# EasyEDA schematic SCH_AidF-Car-Navigation-Computer.json

## Sheets
1 Power Inlet: TITLE: AidF Nav Computer Power Inlet; REV: 1.0; Date: 2024-11-23; Sheet: 1/12; Drawn By: Aidan C Franits; Company: AidF Electronics
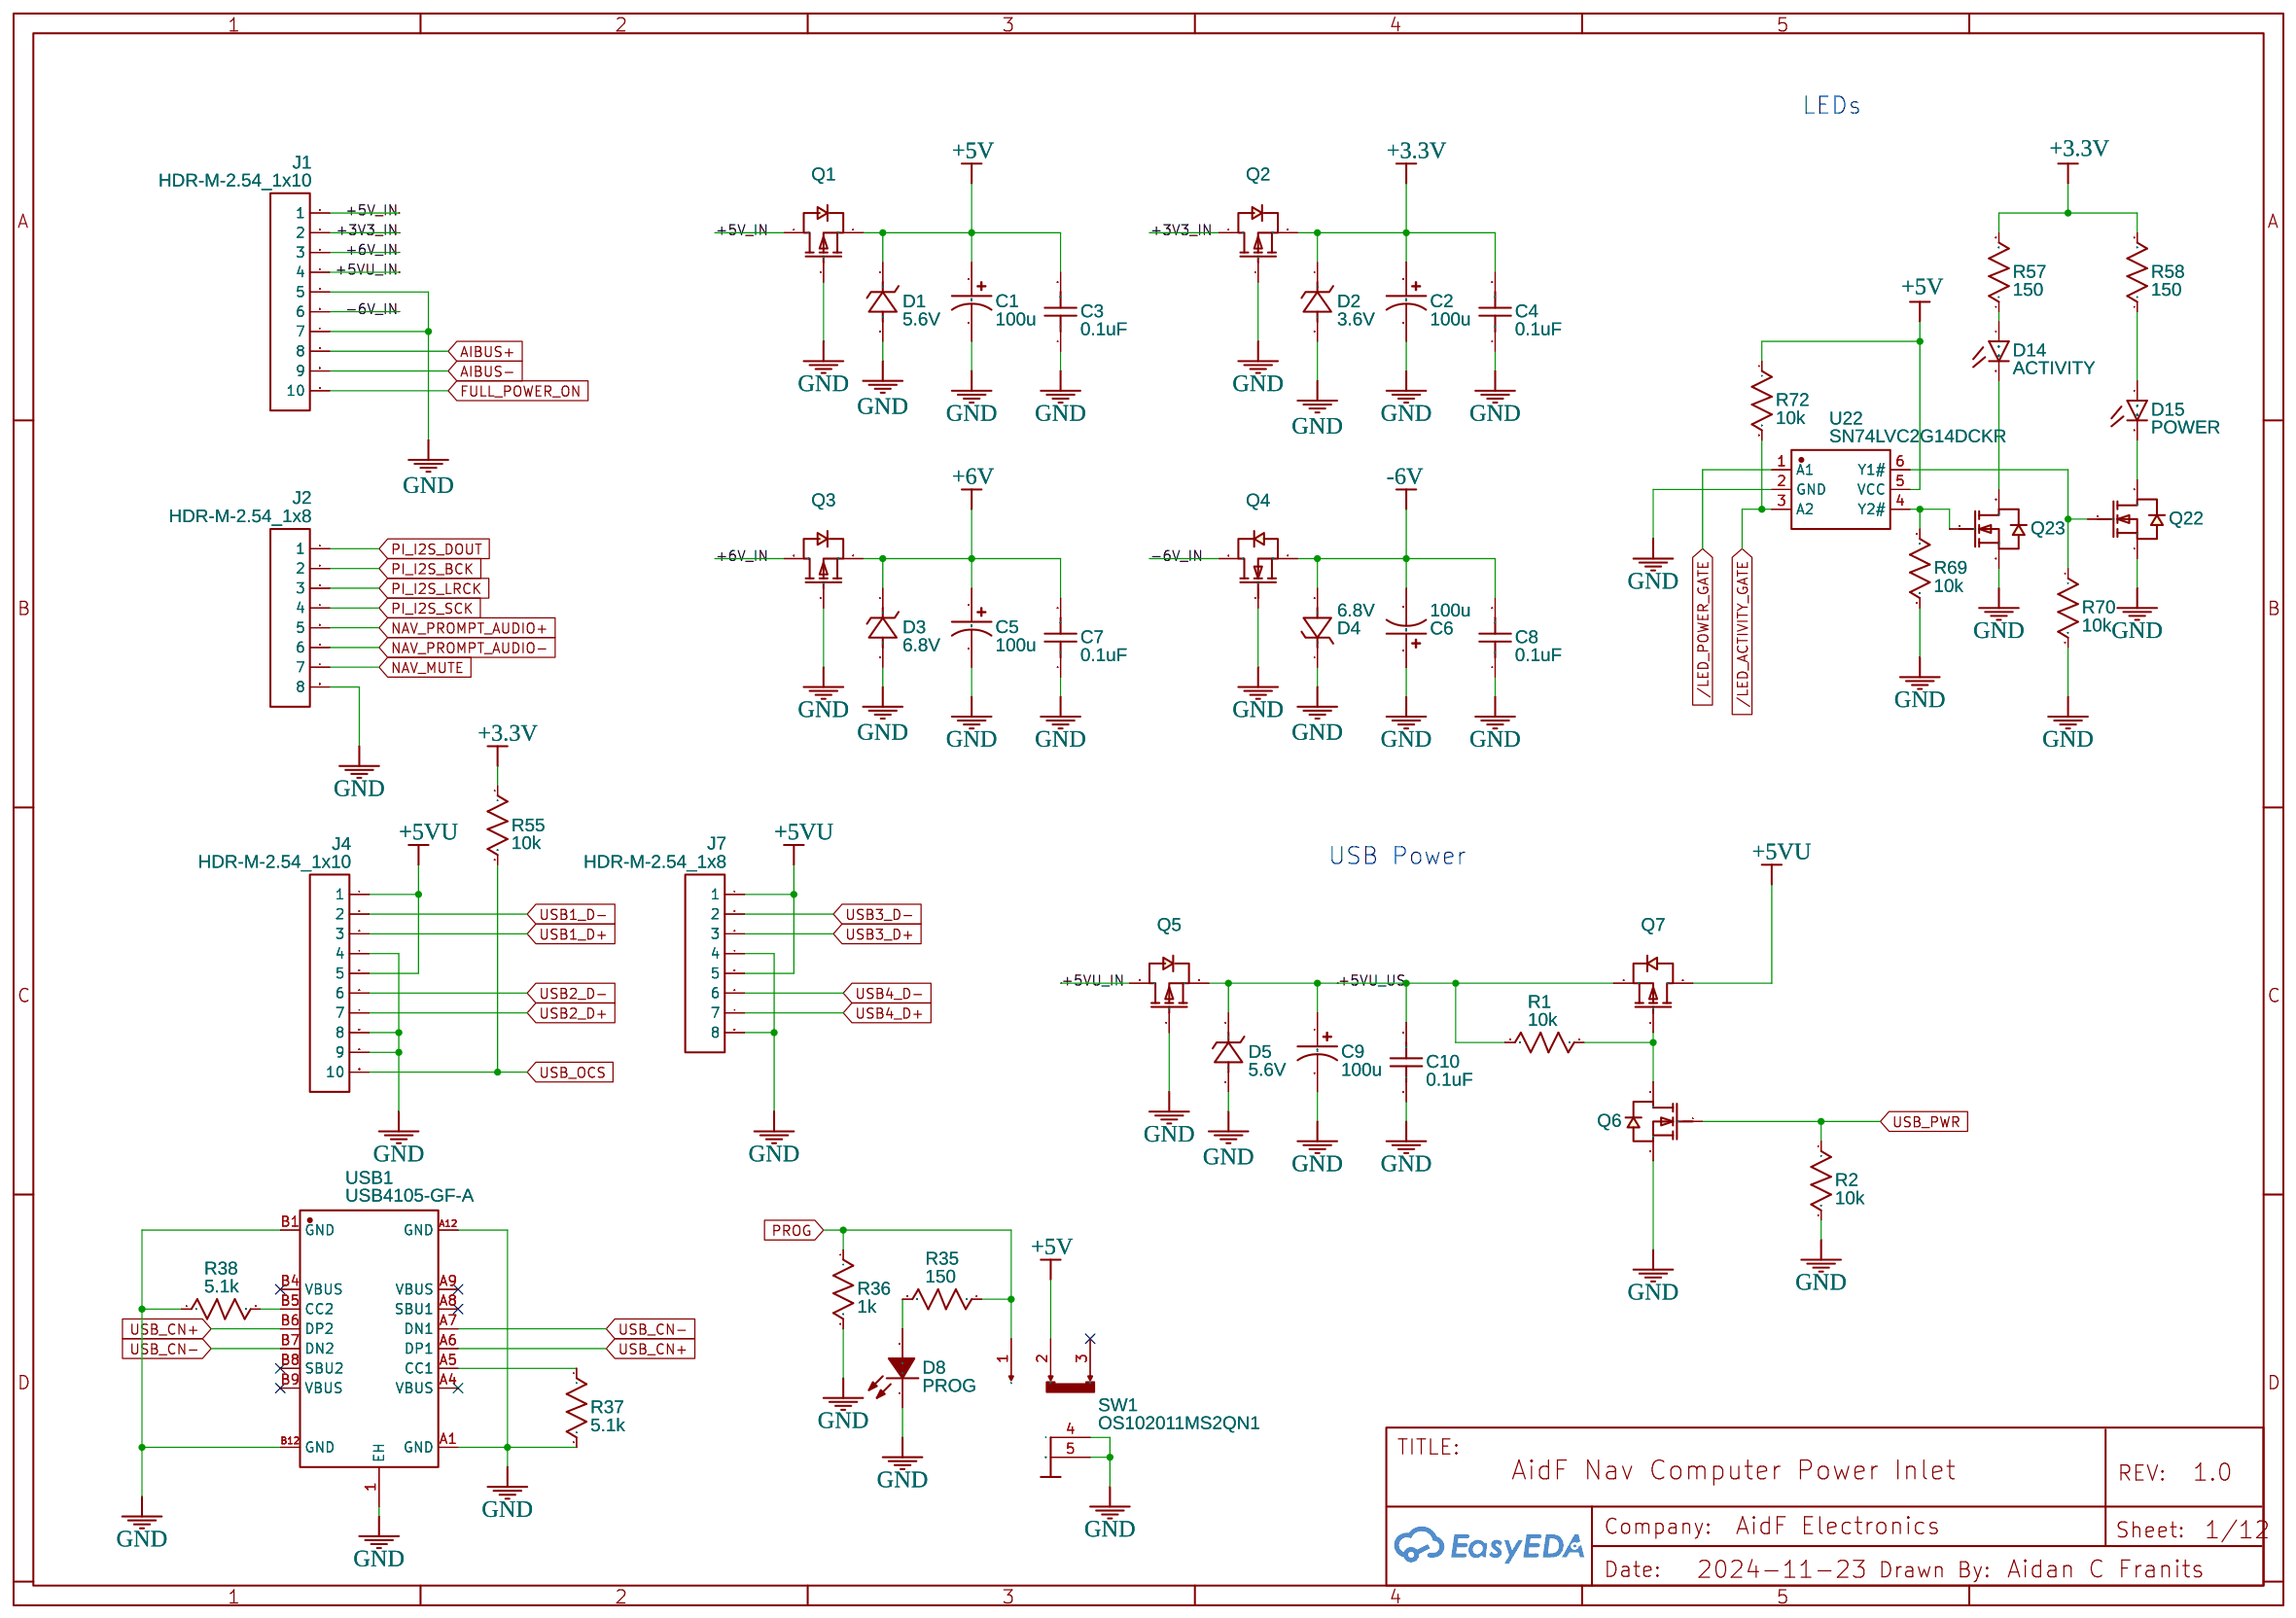
[diagram p0: Power Inlet]
2 Power Switches: TITLE: AidF Nav Computer Power Switches; Date: 2024-11-25; Sheet: 2/12; Drawn By: Aidan C. Franits
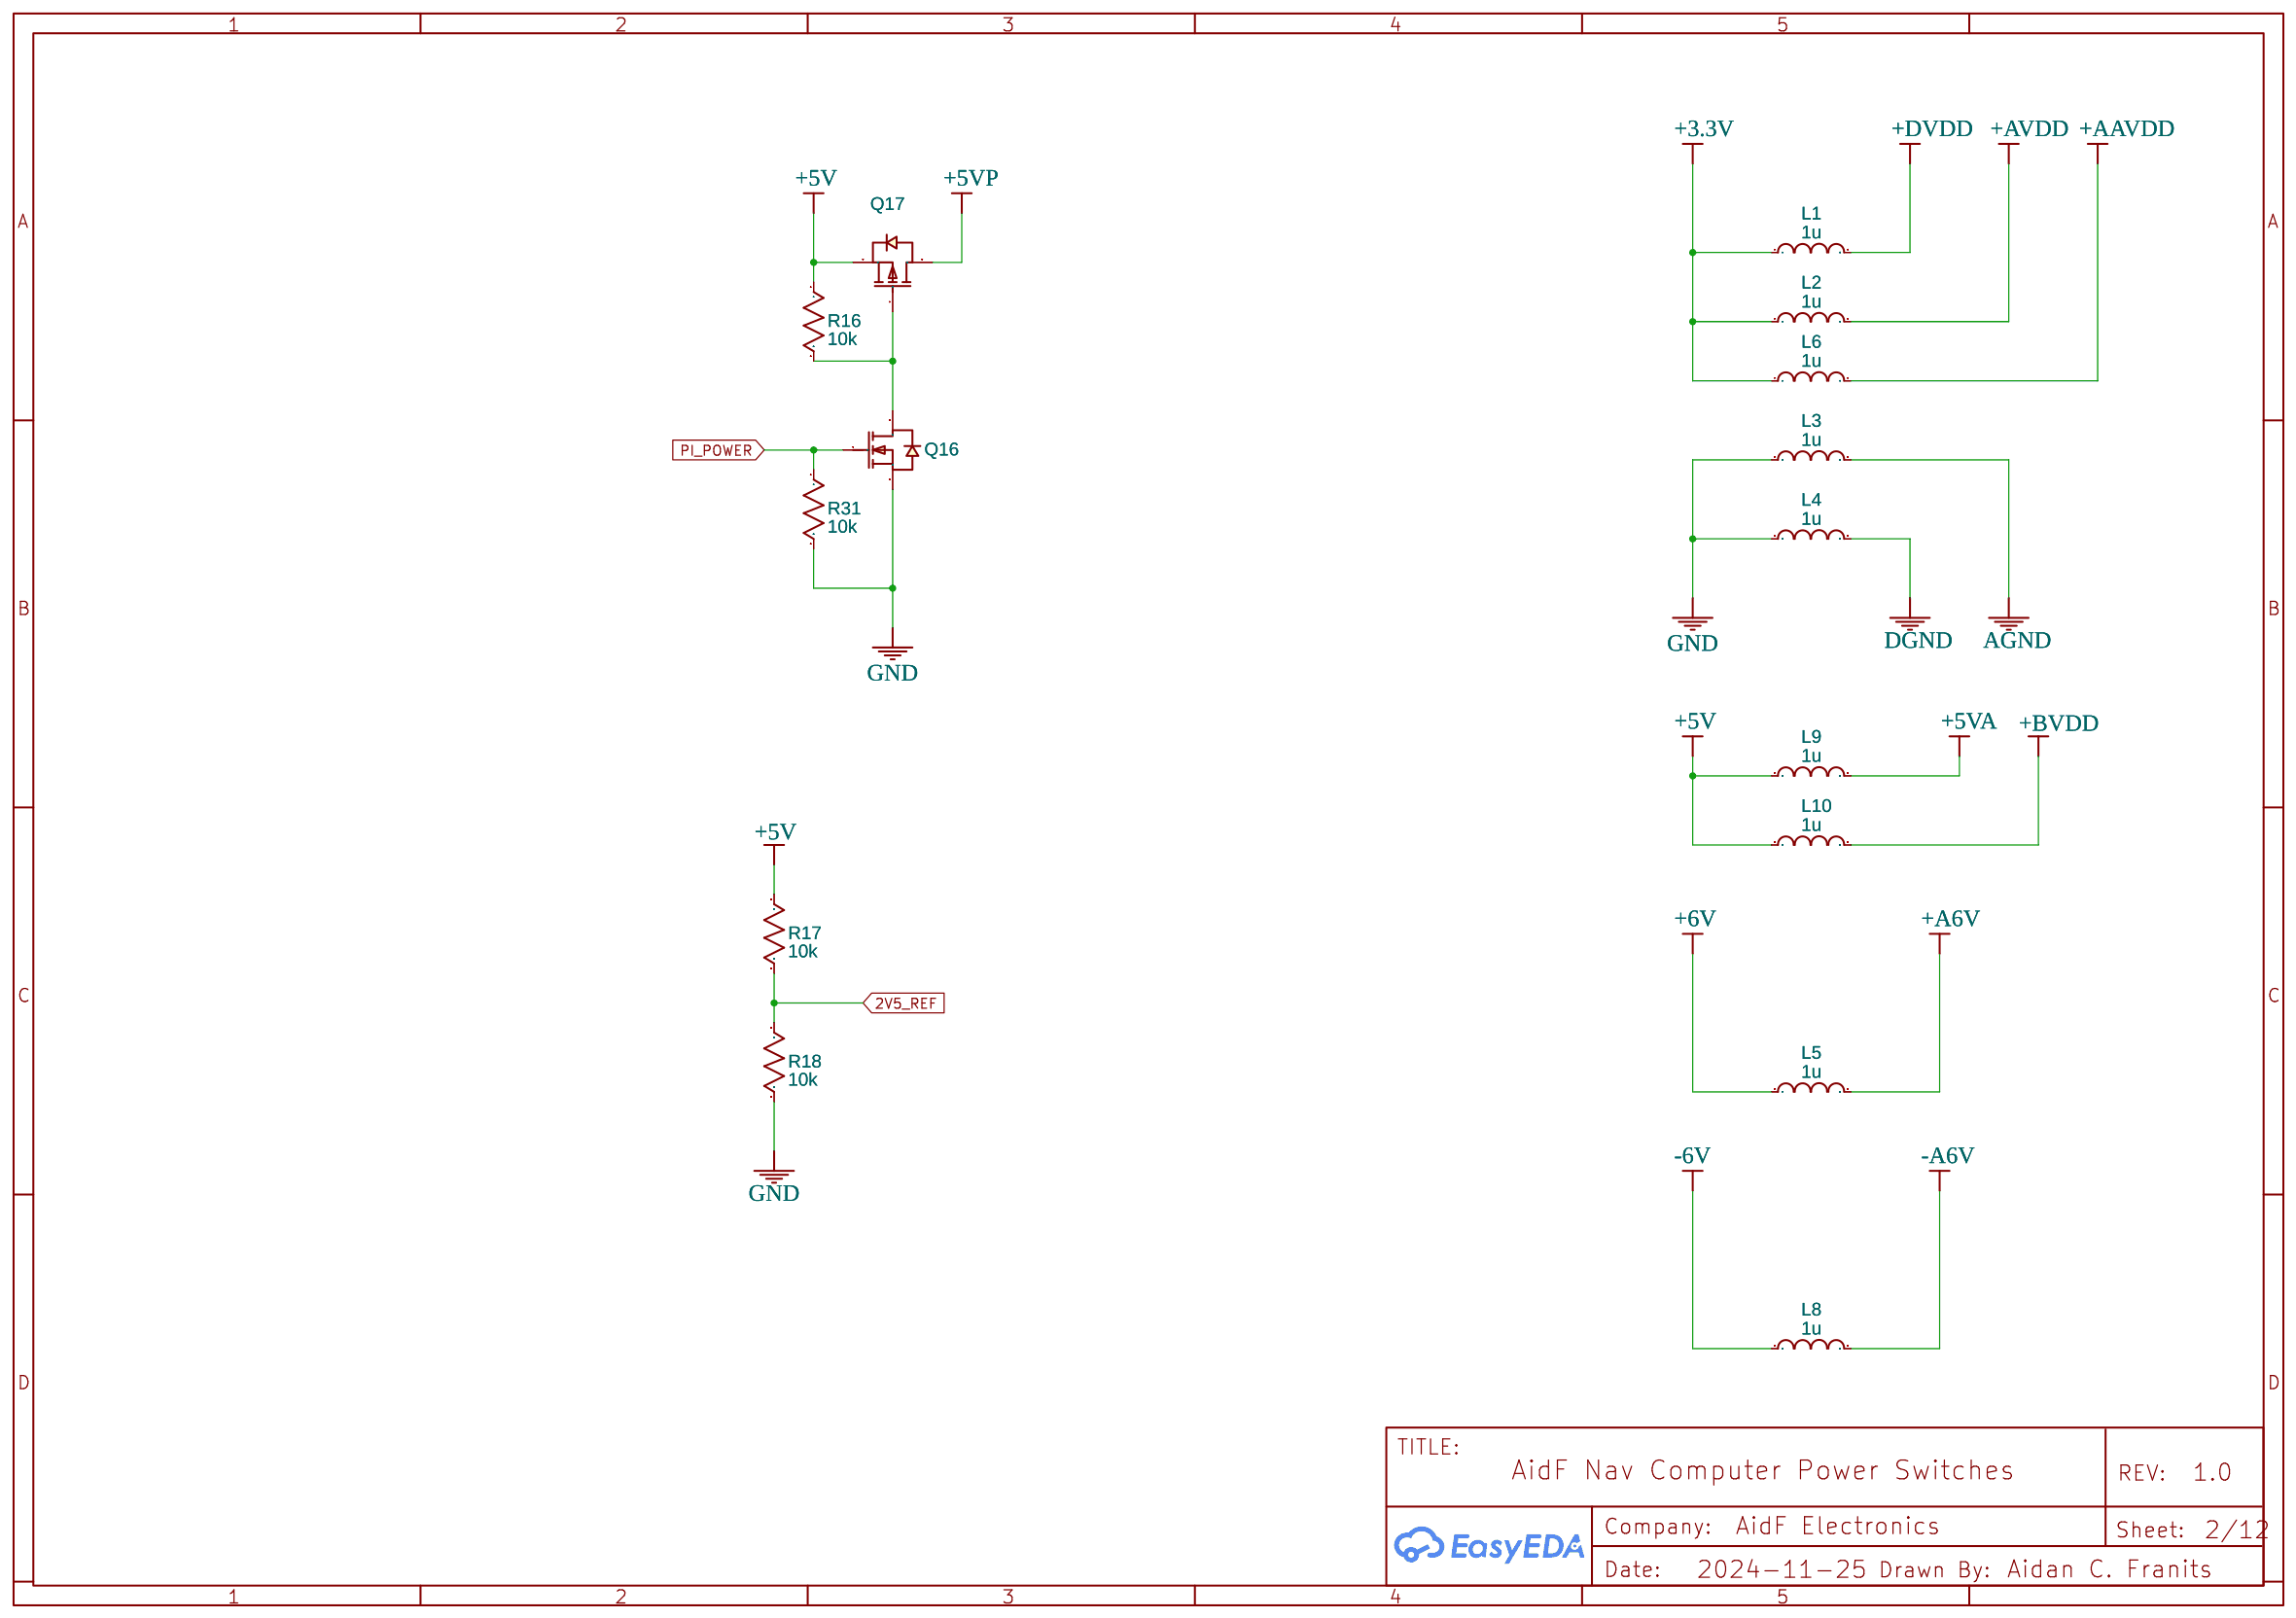
[diagram p1: Power Switches]
3 Pi Interface: TITLE: AidF Nav Computer Pi Interface; Sheet: 3/12; Drawn By: Aidan C. Franits
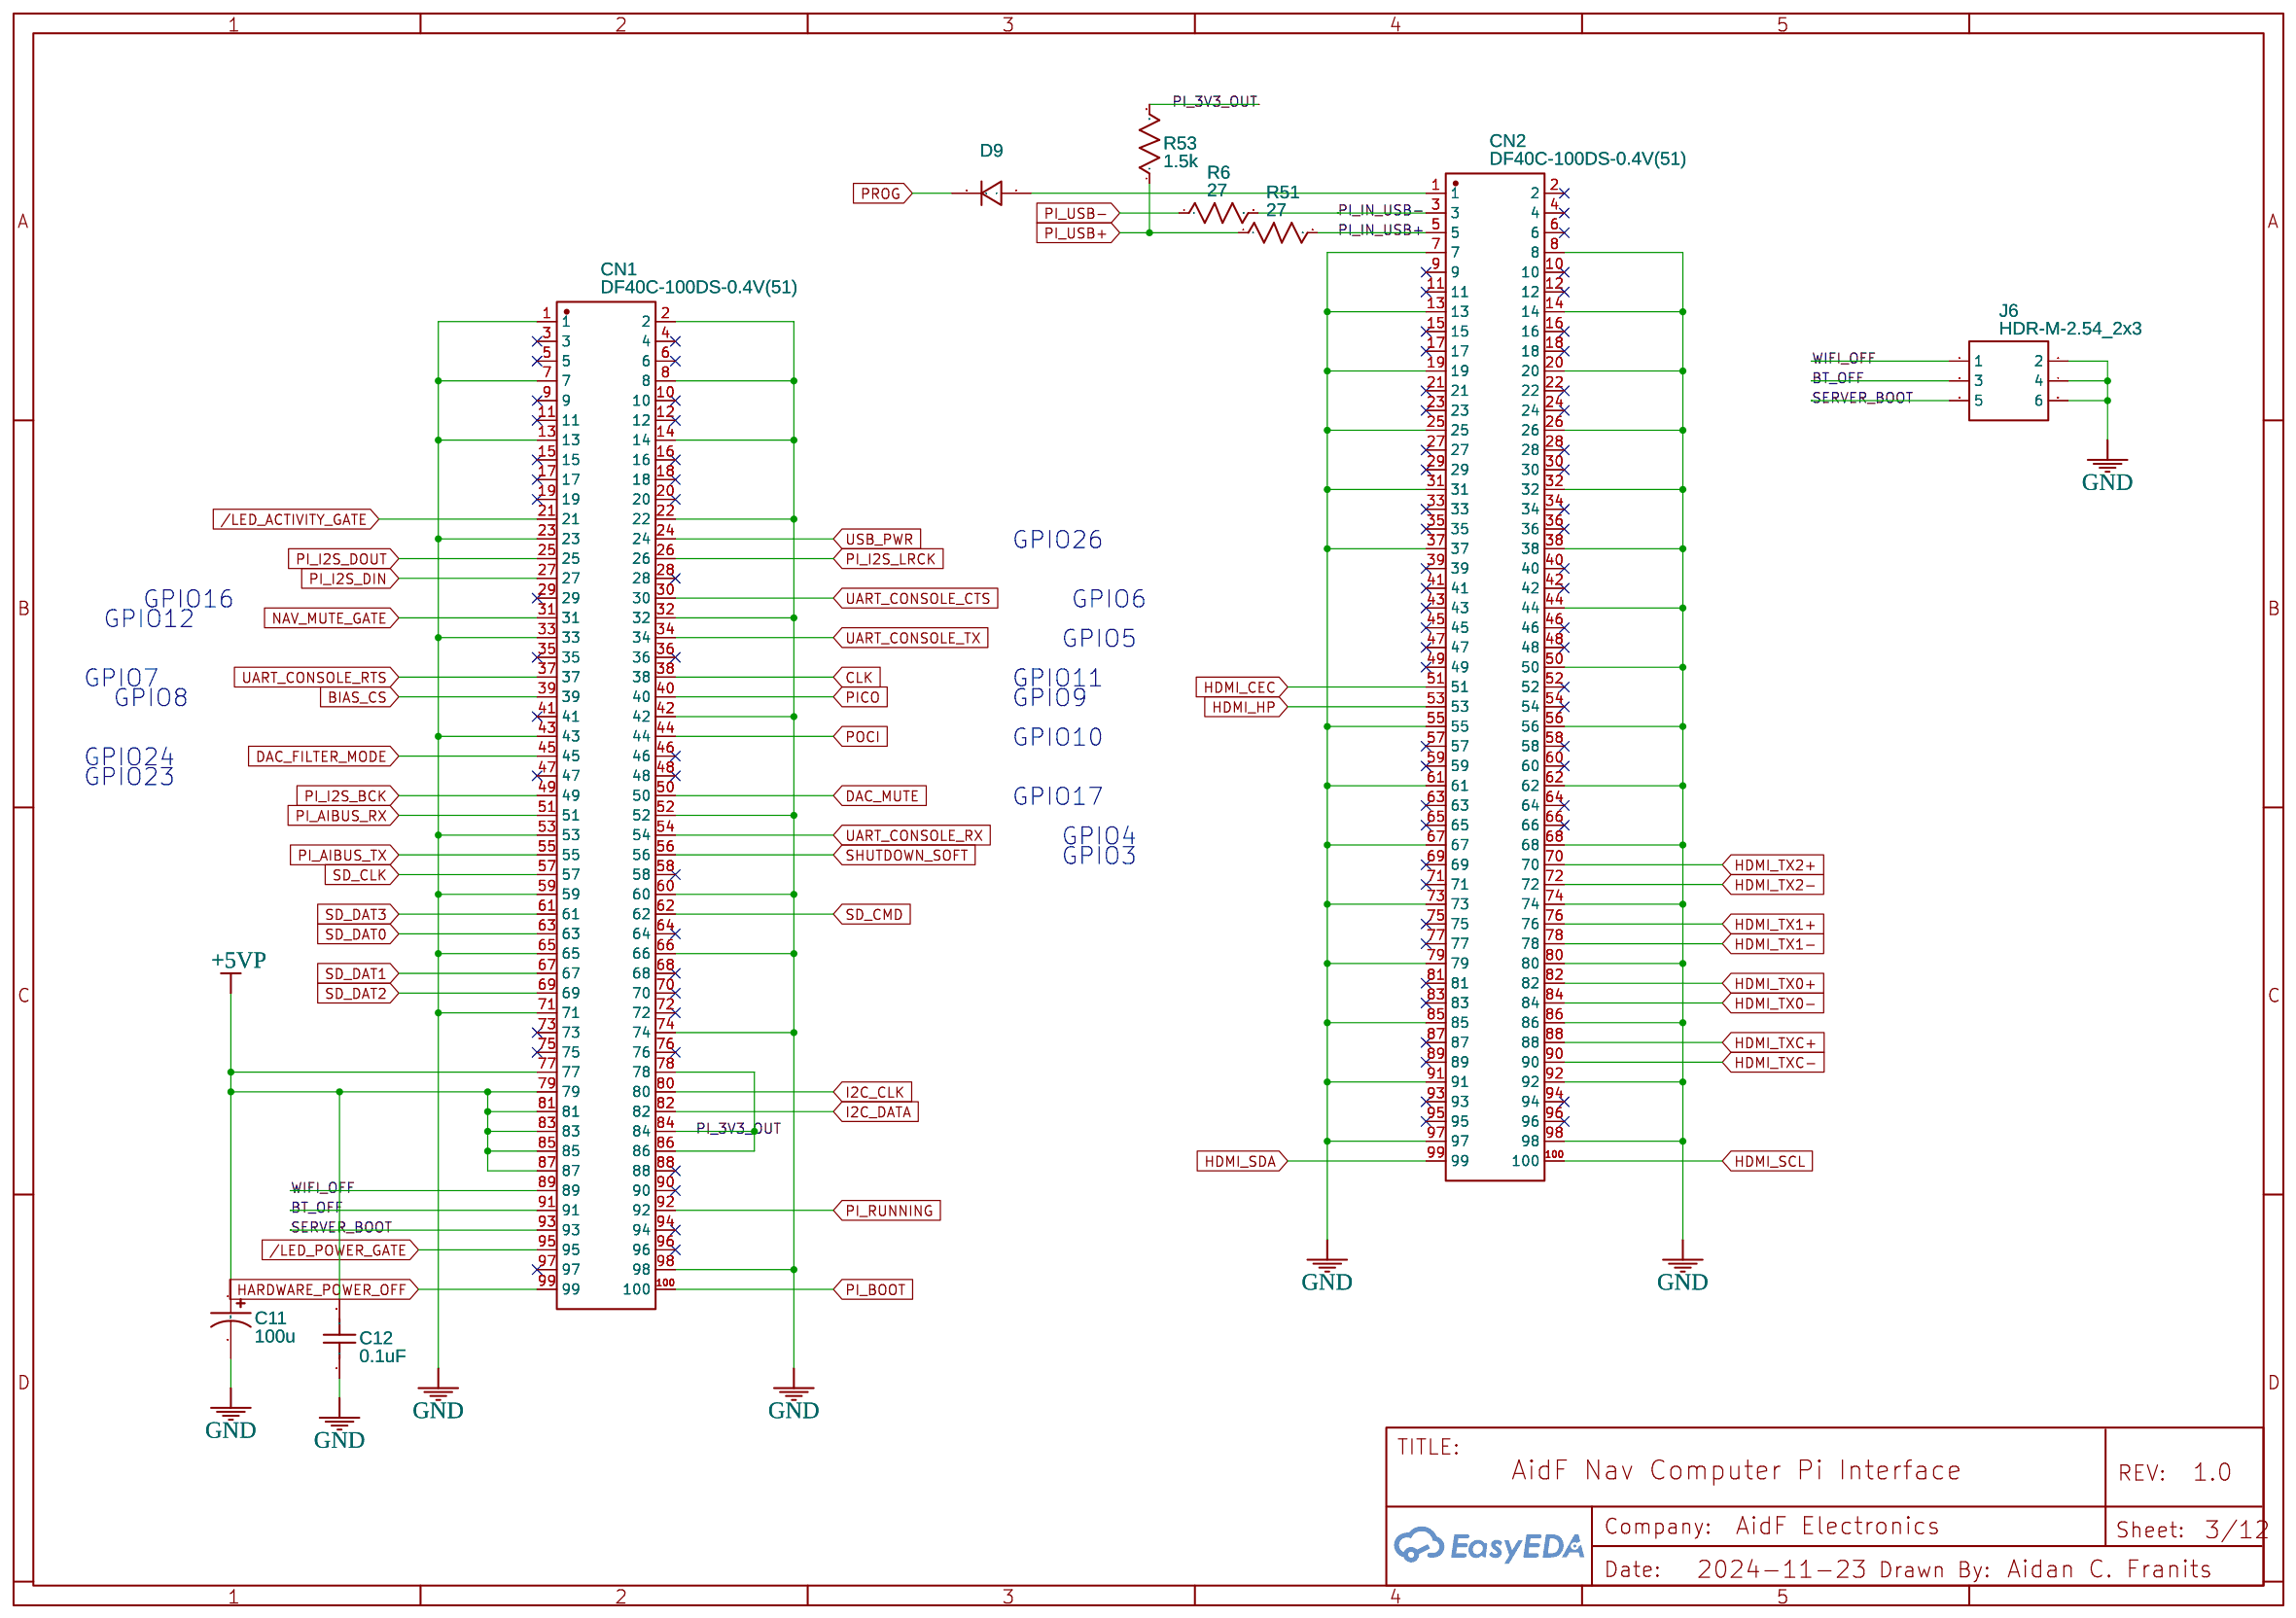
[diagram p2: Pi Interface]
4 AIBus Inlet: TITLE: AidF Navigation Computer AIBus Inlet; Date: 2024-11-24; Sheet: 4/12; Drawn By: Aidan C. Franits
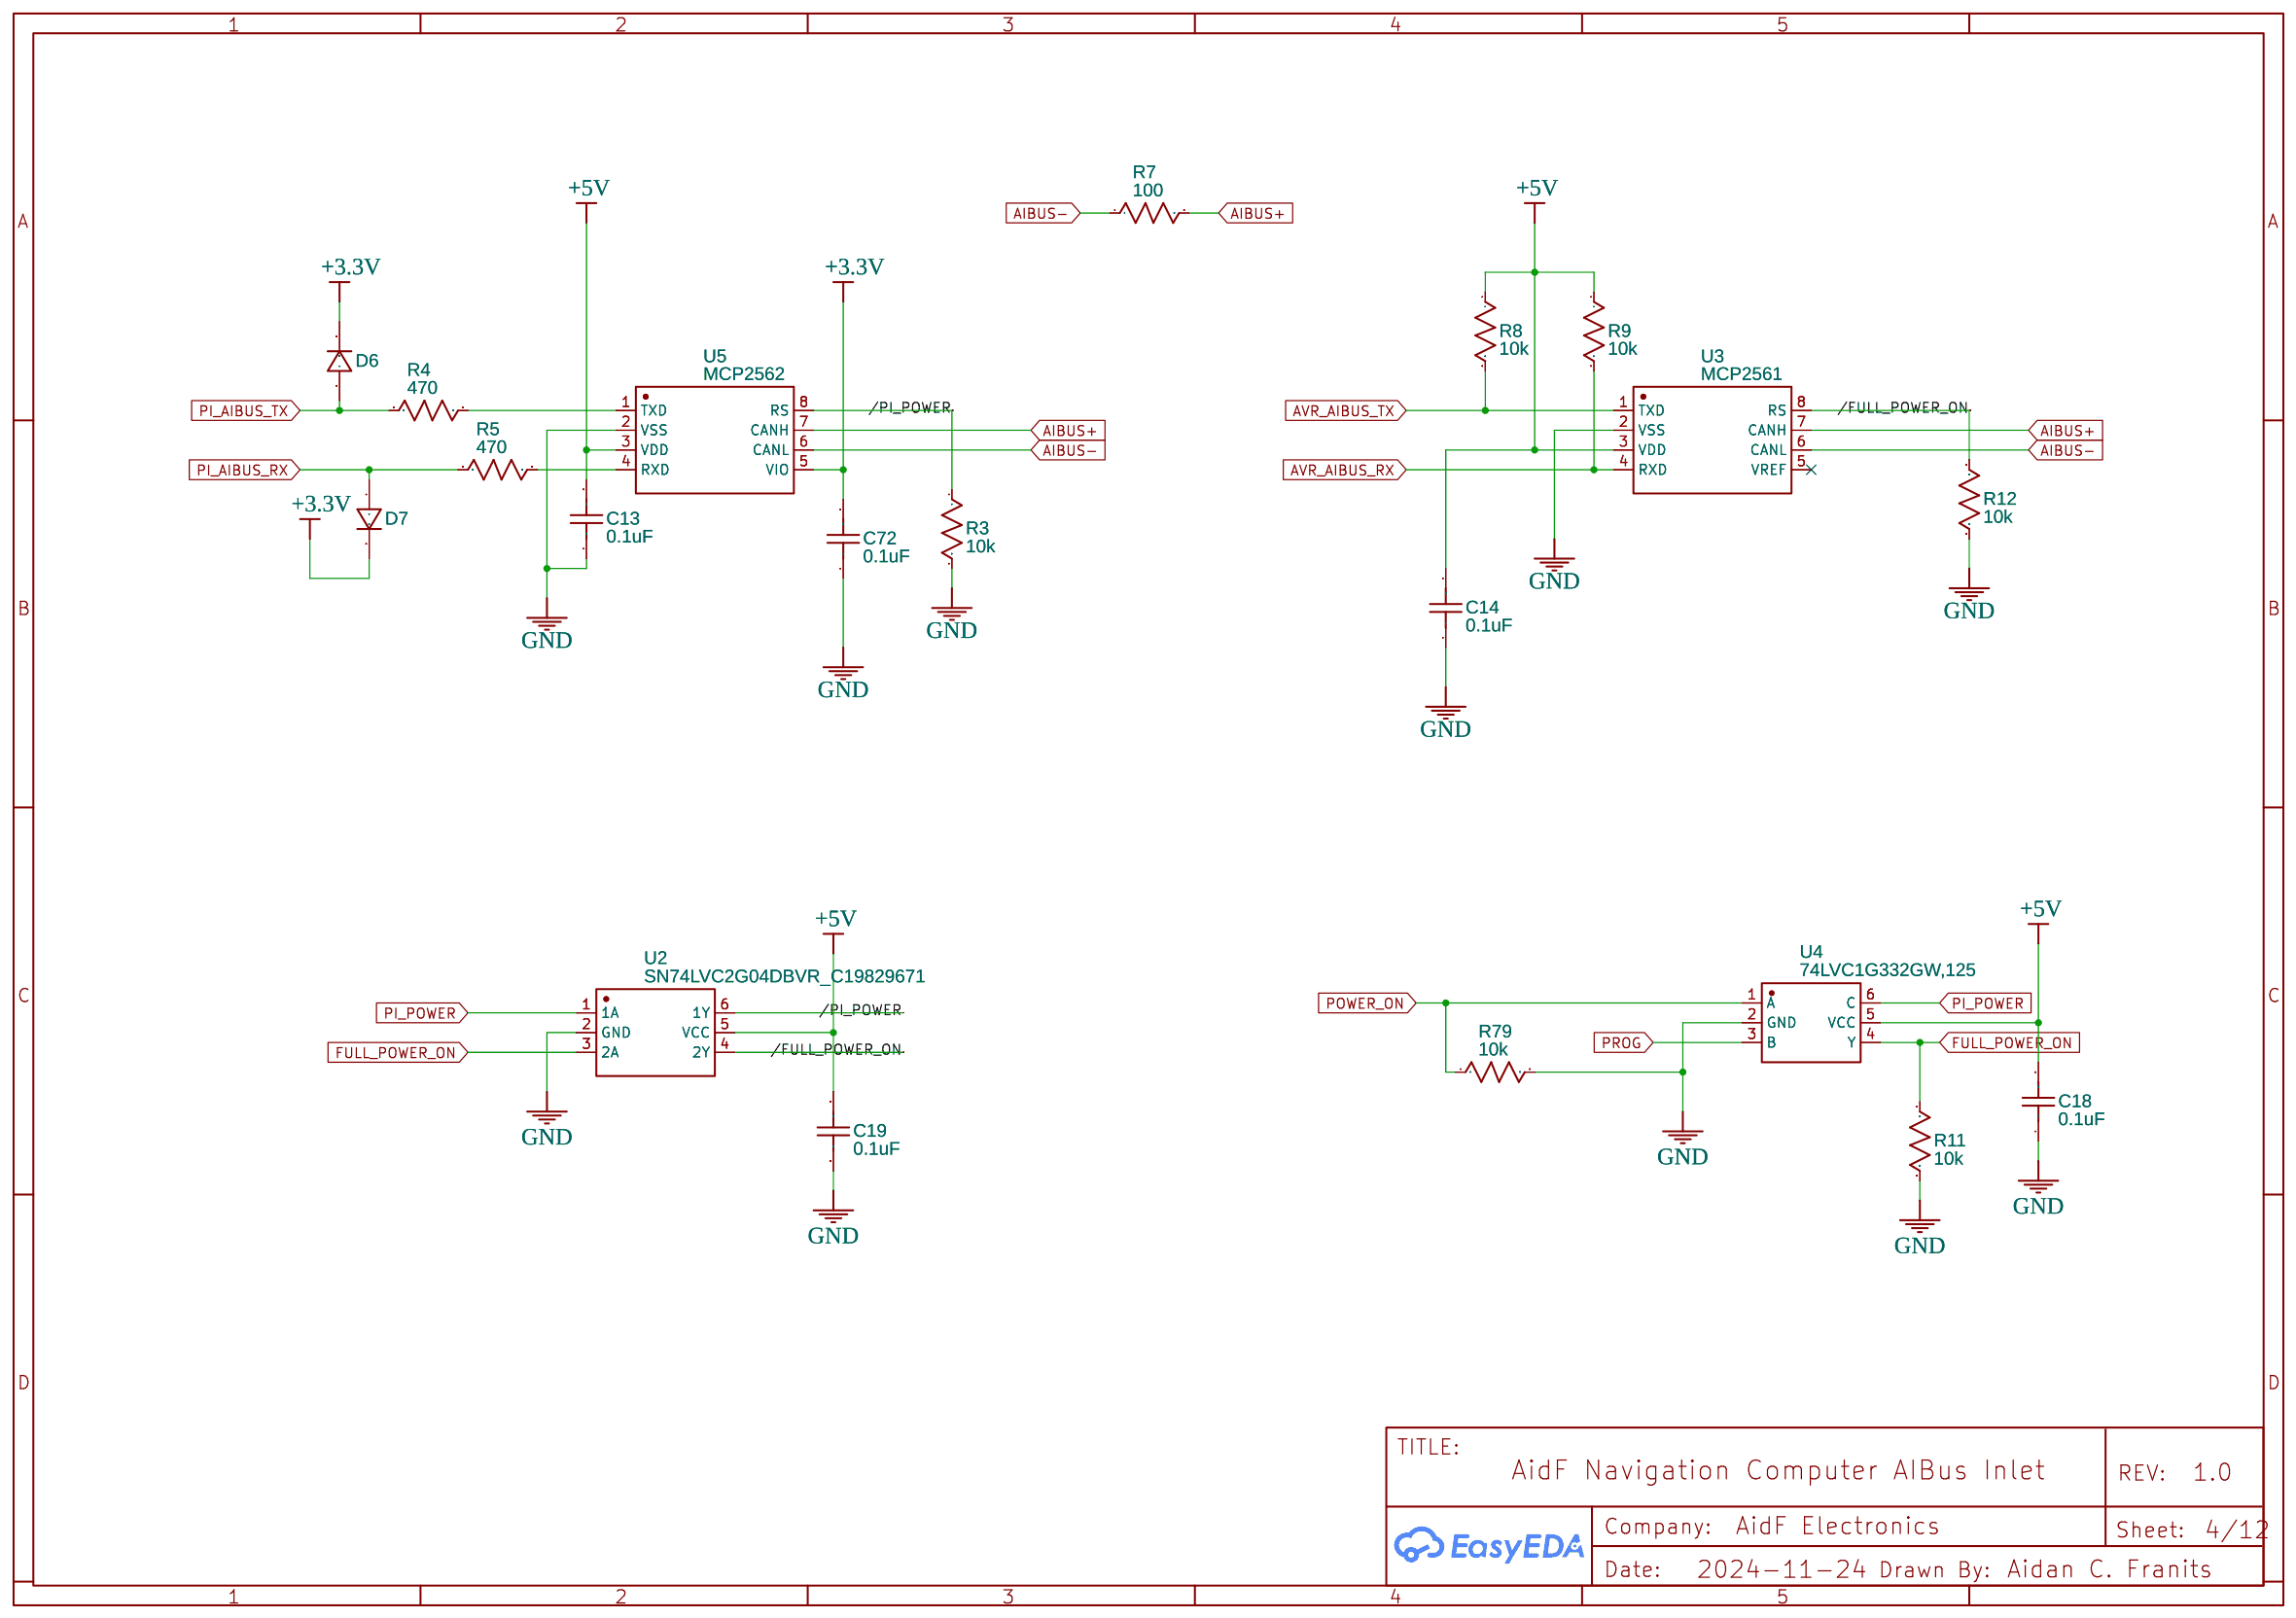
[diagram p3: AIBus Inlet]
5 Digital Audio Processor: TITLE: AidF Nav Computer Digital Audio Processor; Date: 2024-12-08; Sheet: 5/12; Drawn By: Aidan C. Franits
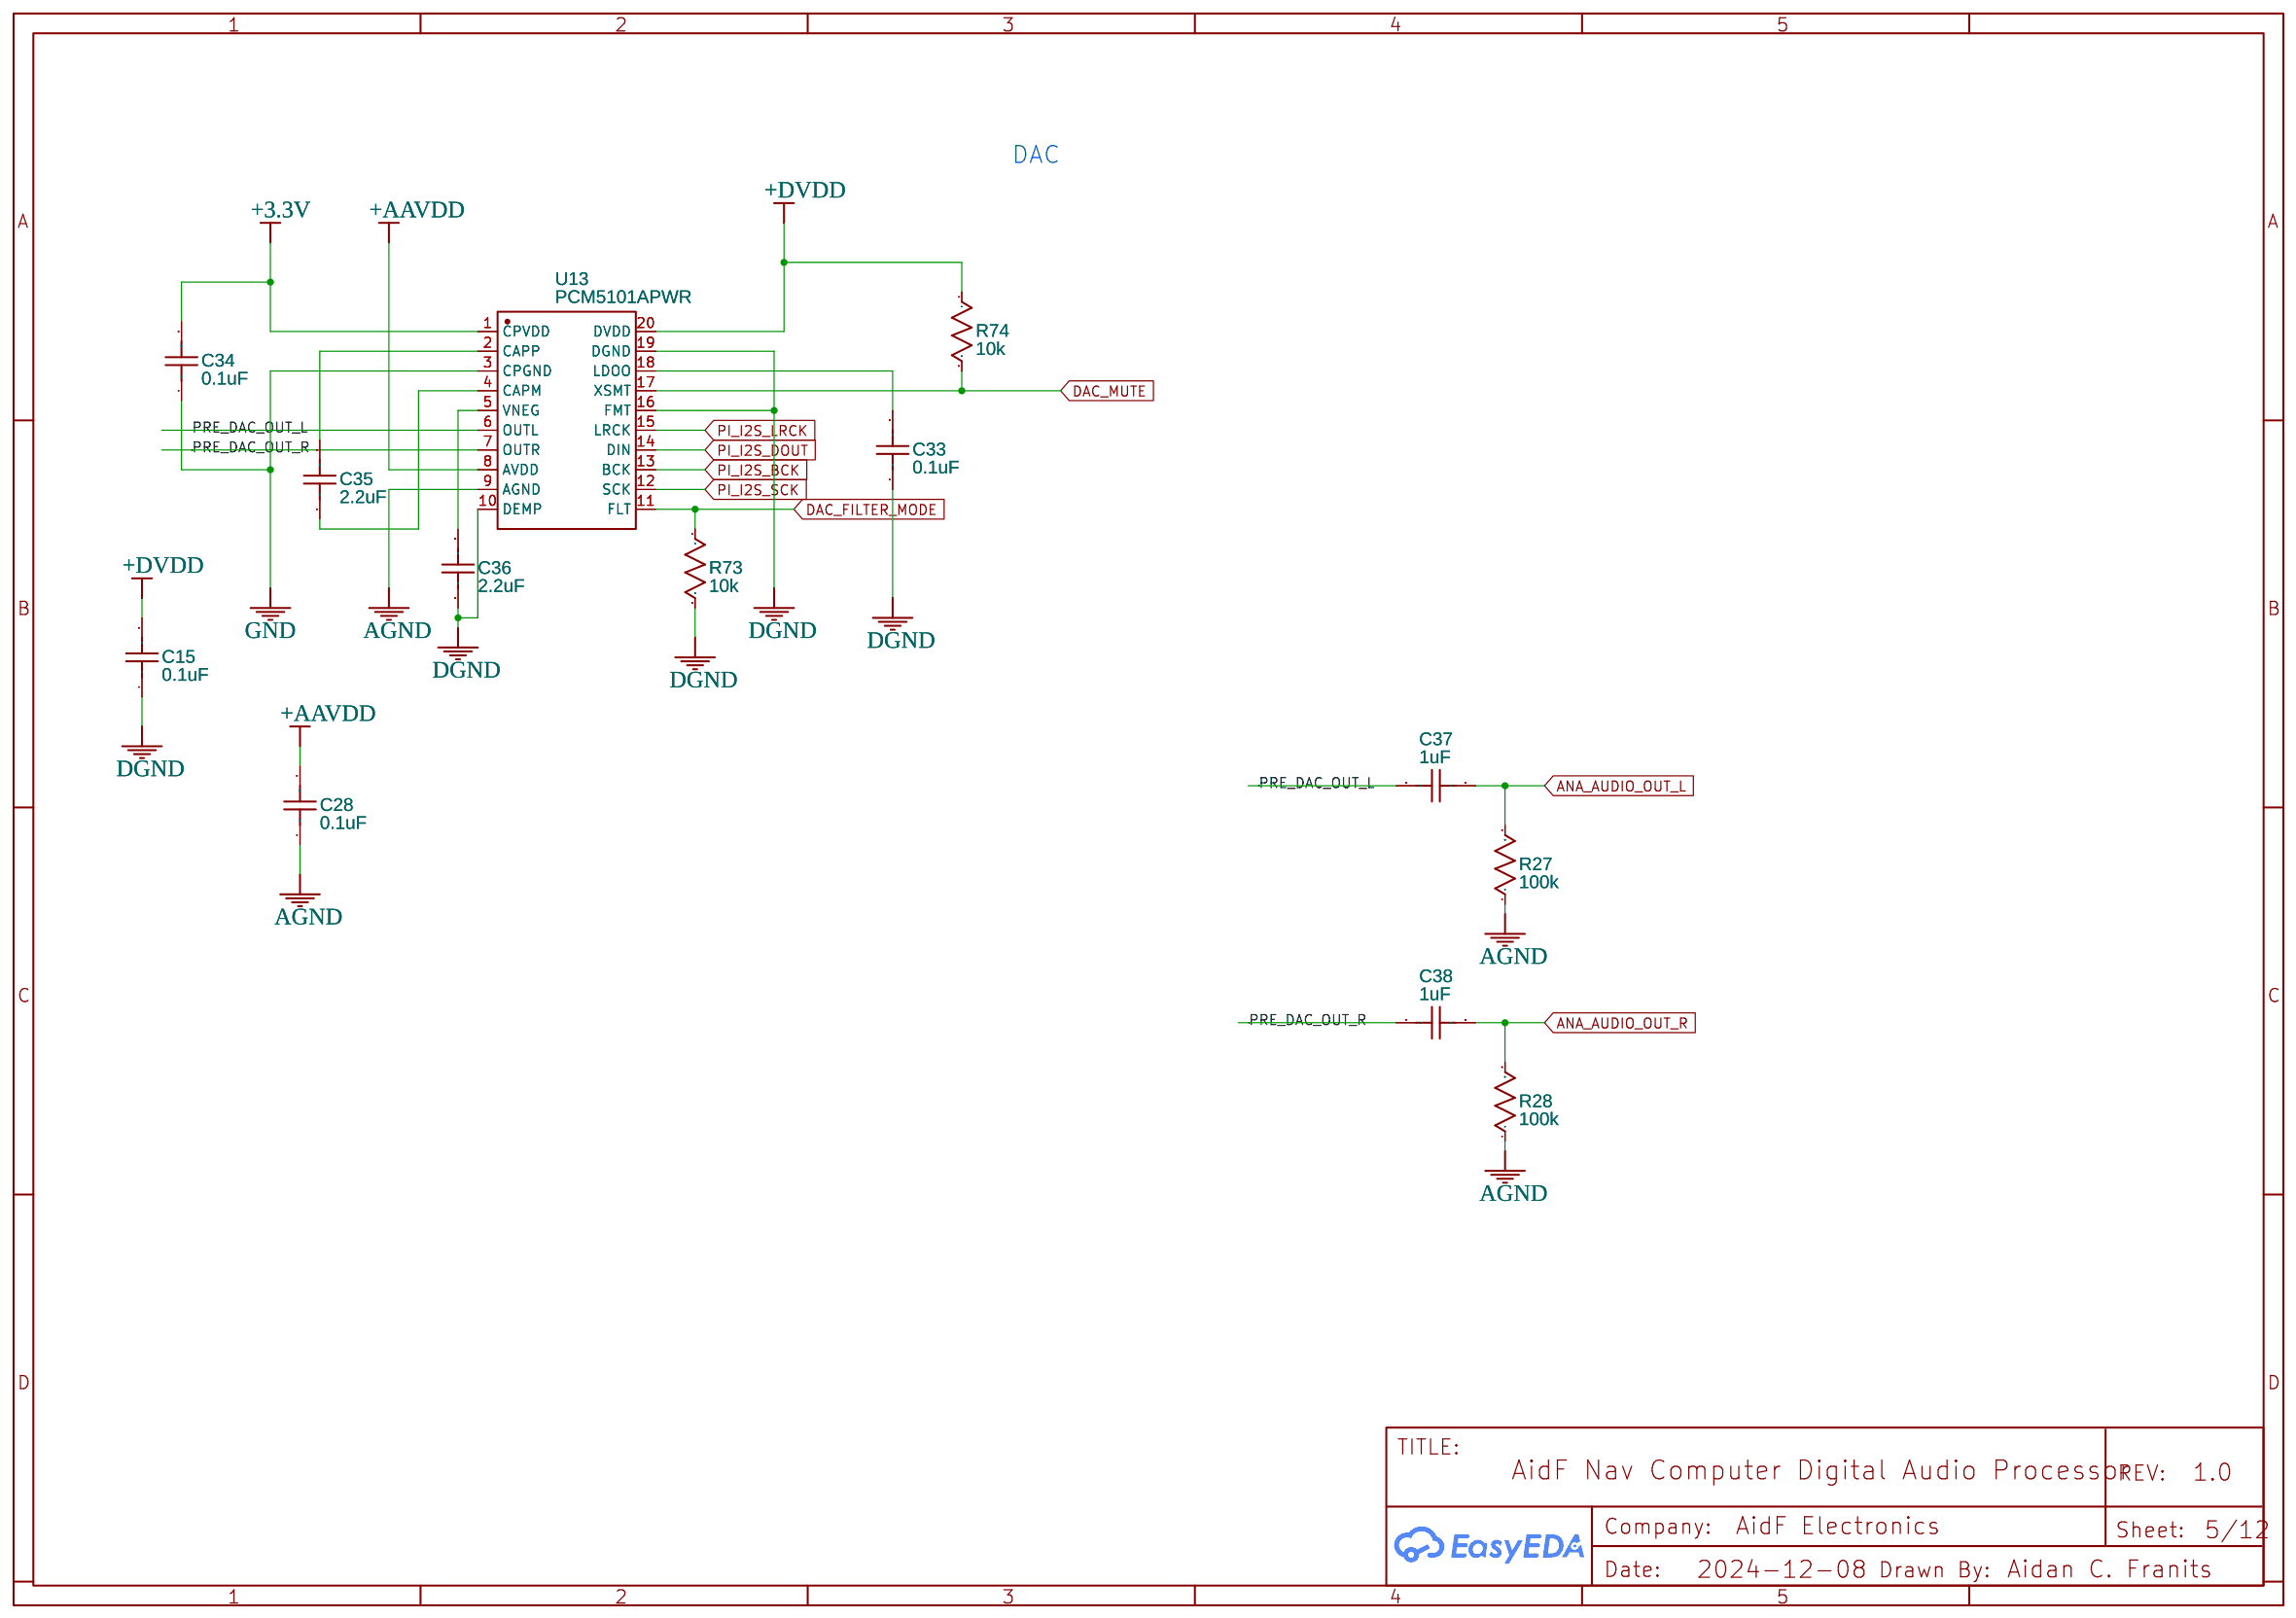
[diagram p4: Digital Audio Processor]
6 Analog Audio Processor: TITLE: AidF Nav Computer Analog Audio Processor; Date: 2024-12-08; Sheet: 6/12
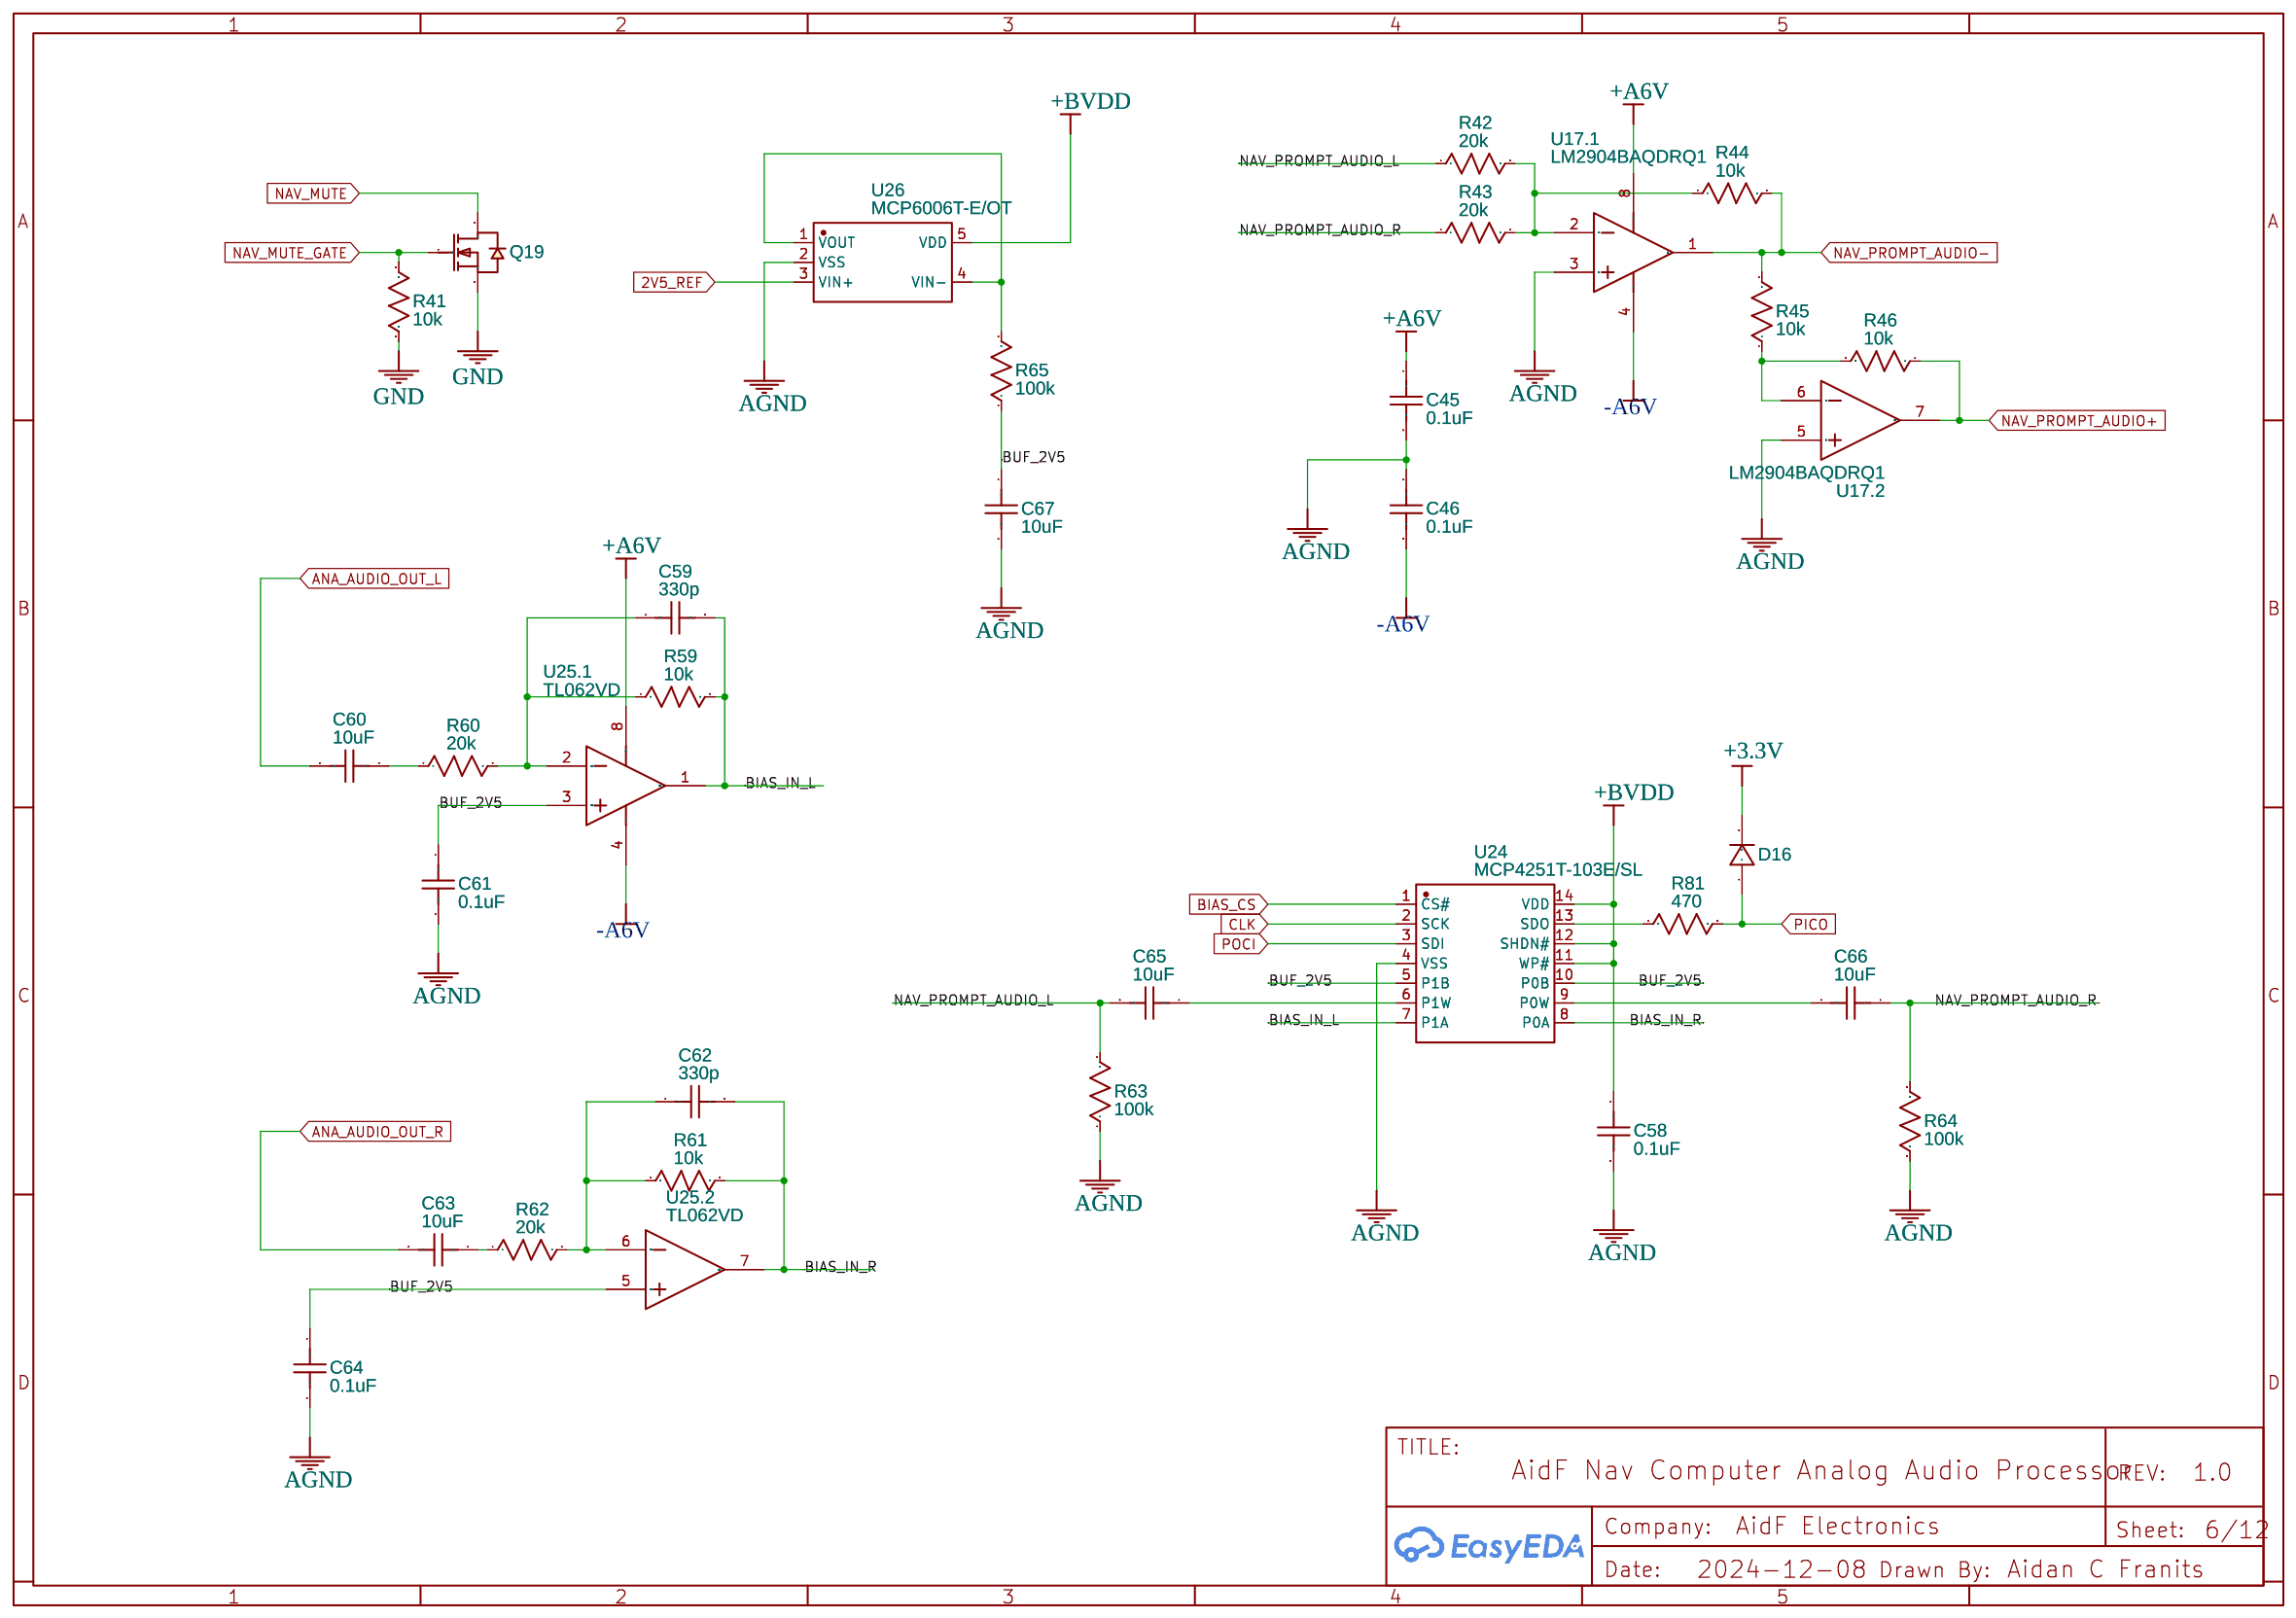
[diagram p5: Analog Audio Processor]
7 Mic ADC: TITLE: AidF Nav System Mic ADC; Date: 2024-12-14; Sheet: 7/12
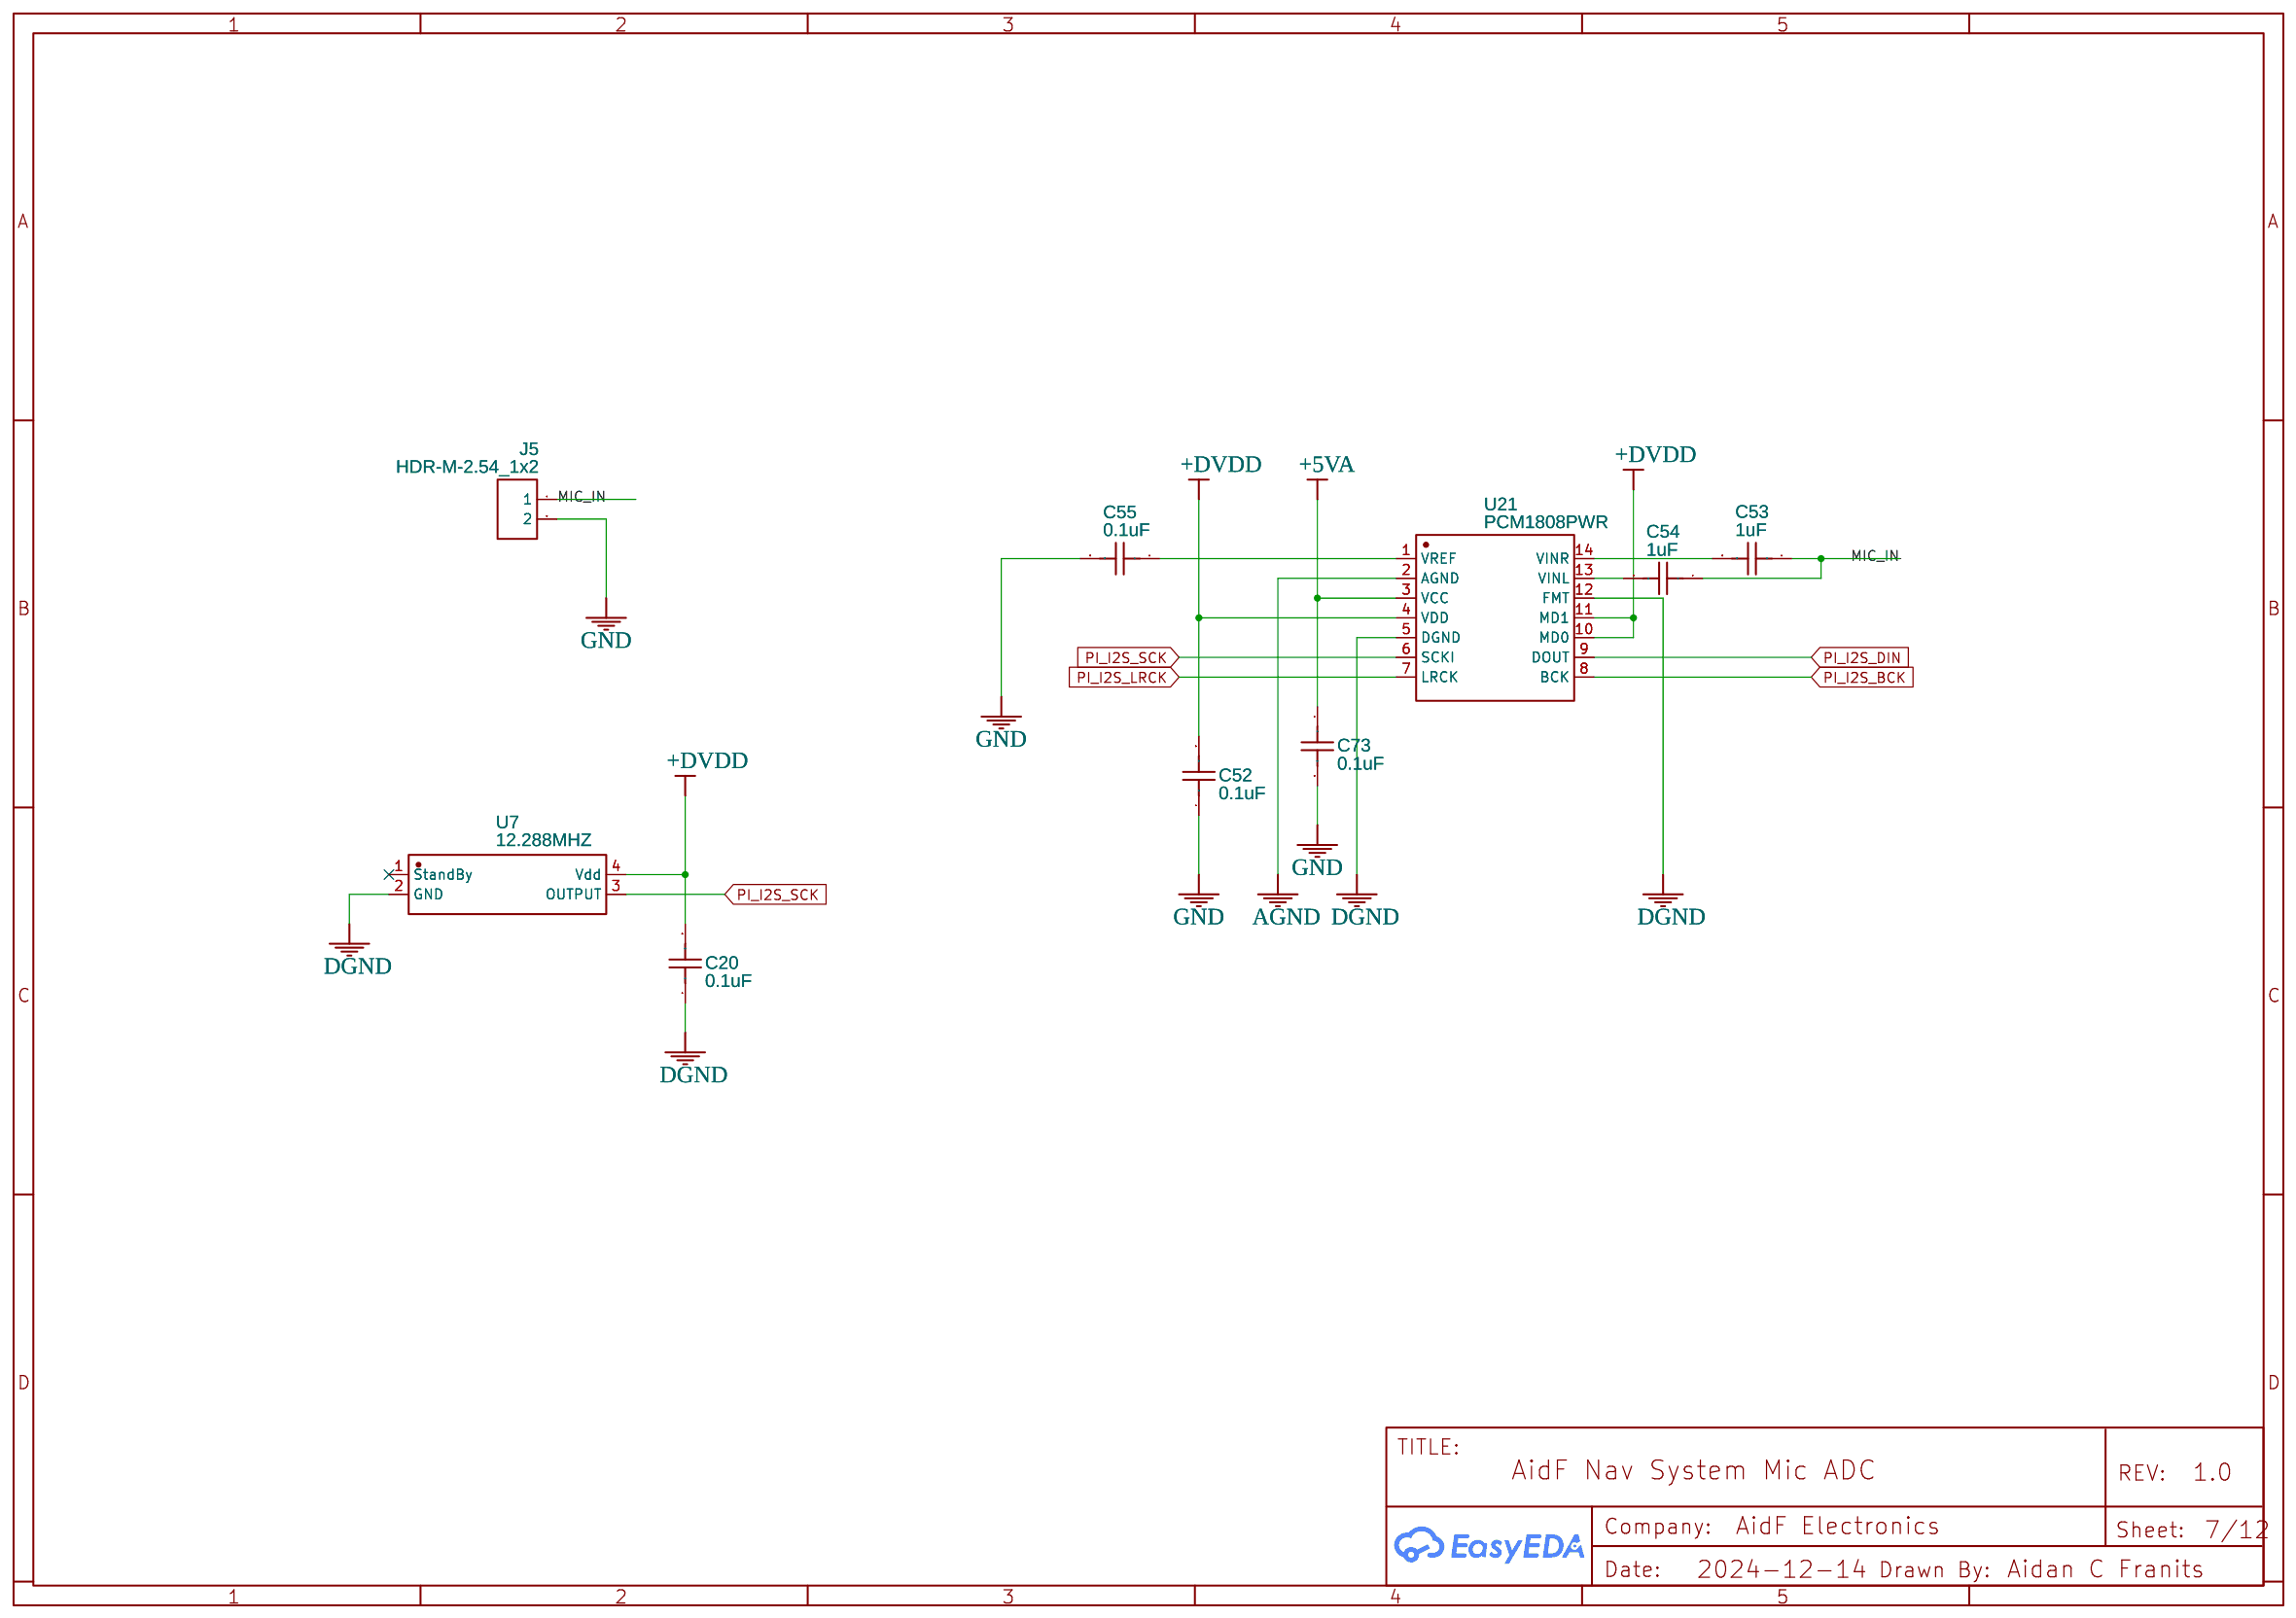
[diagram p6: Mic ADC]
8 USB Inlet/Switch: TITLE: AidF Nav Computer USB Inlet/Switch; Date: 2025-12-10; Sheet: 8/12
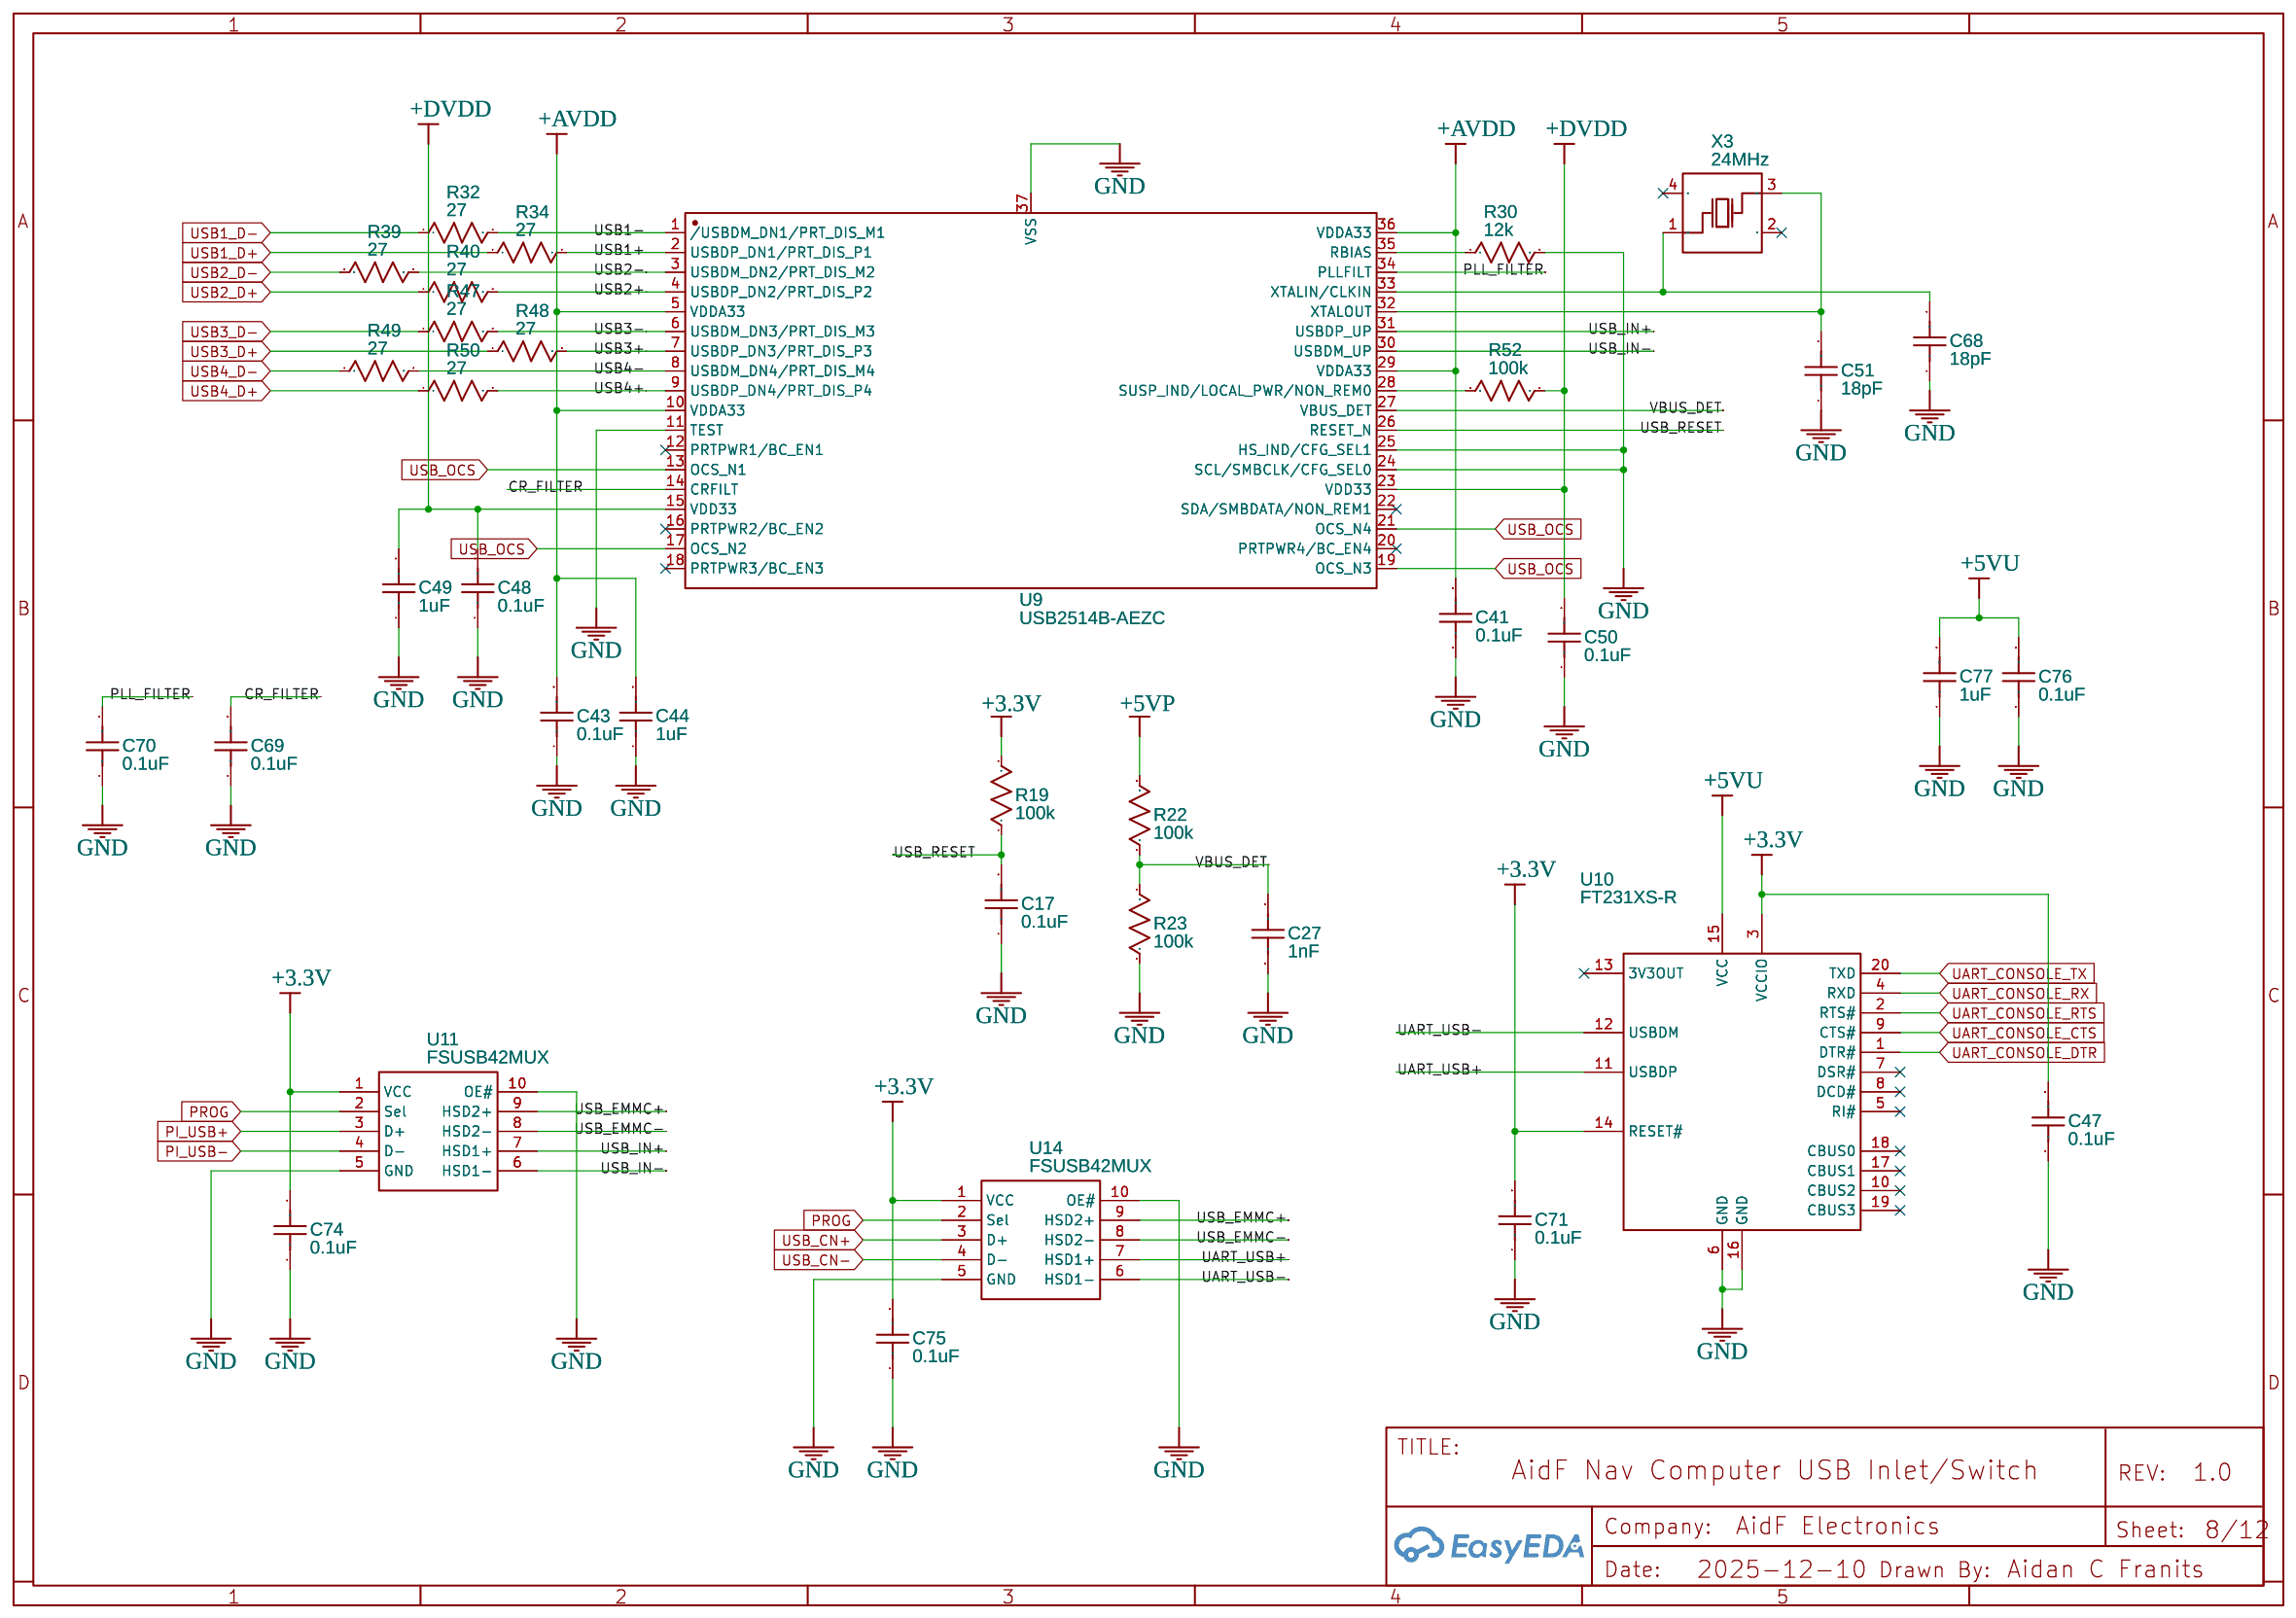
[diagram p7: USB Inlet/Switch]
9 Carplay Interface: TITLE: AidF Nav Computer Carplay Interface; Date: 2024-12-14; Sheet: 9/12
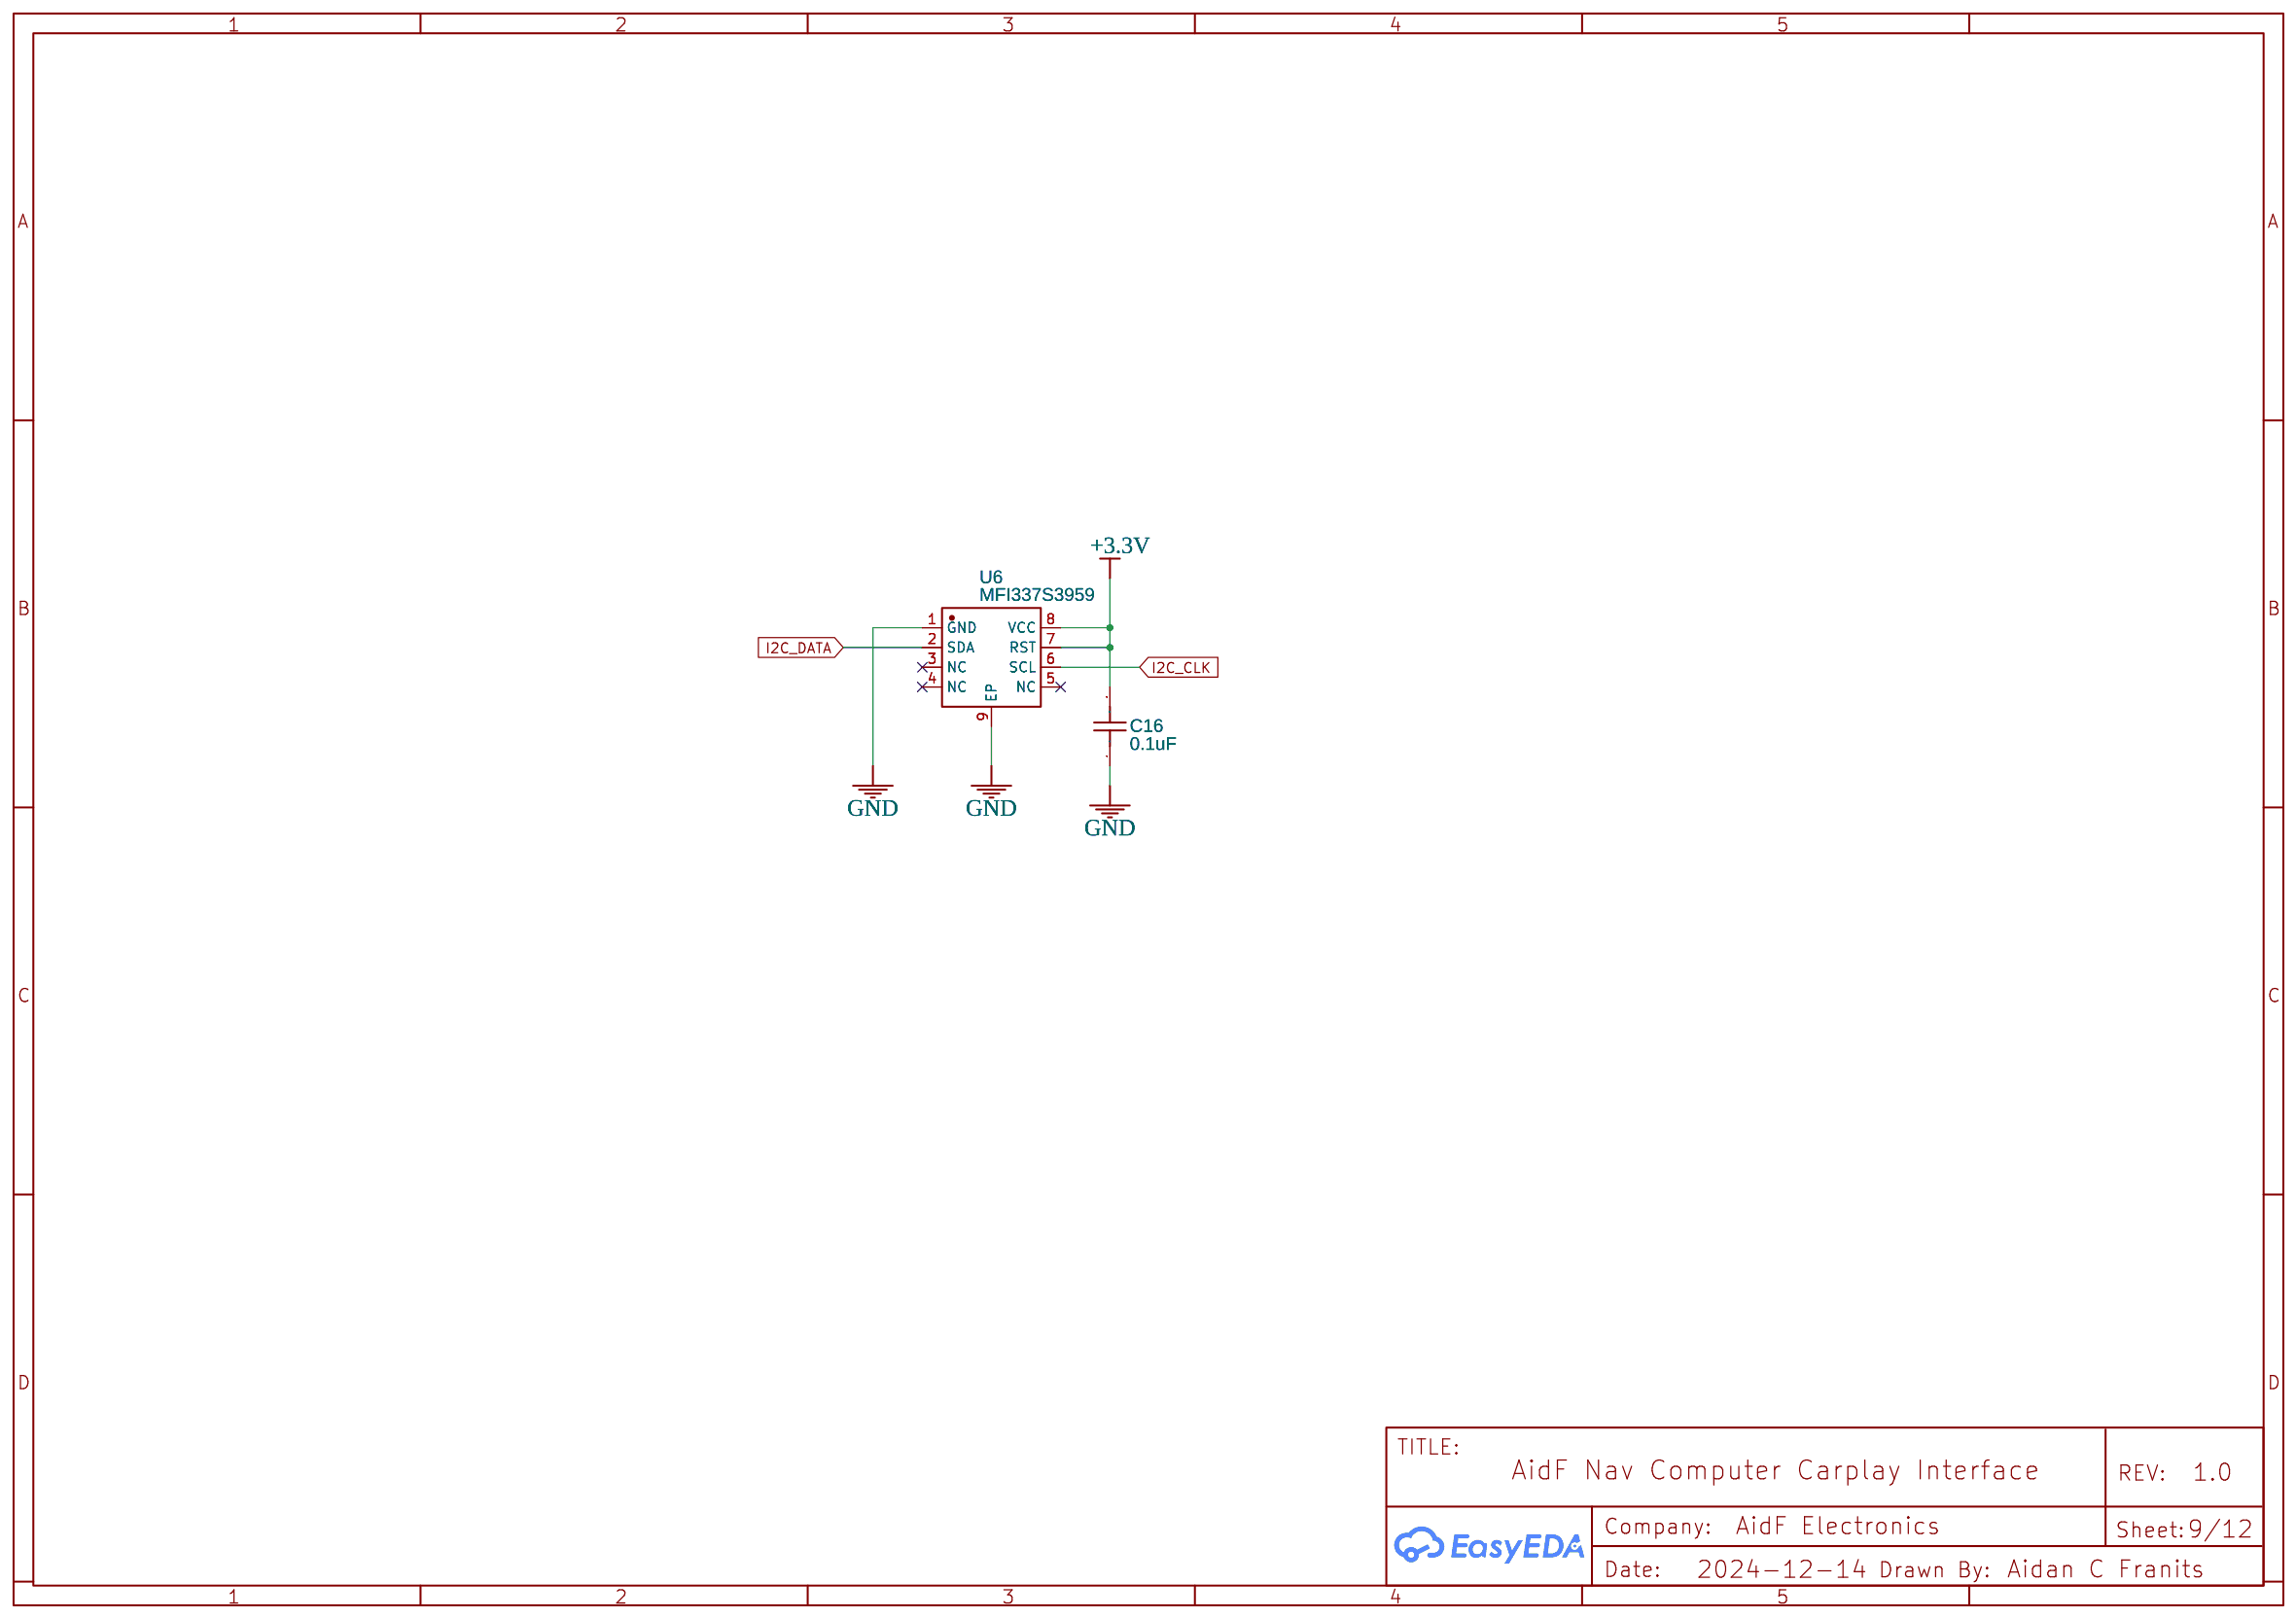
[diagram p8: Carplay Interface]
10 AVR Interface: TITLE: AidF Nav Computer AVR Interface; Date: 2024-12-08; Sheet: 10/12
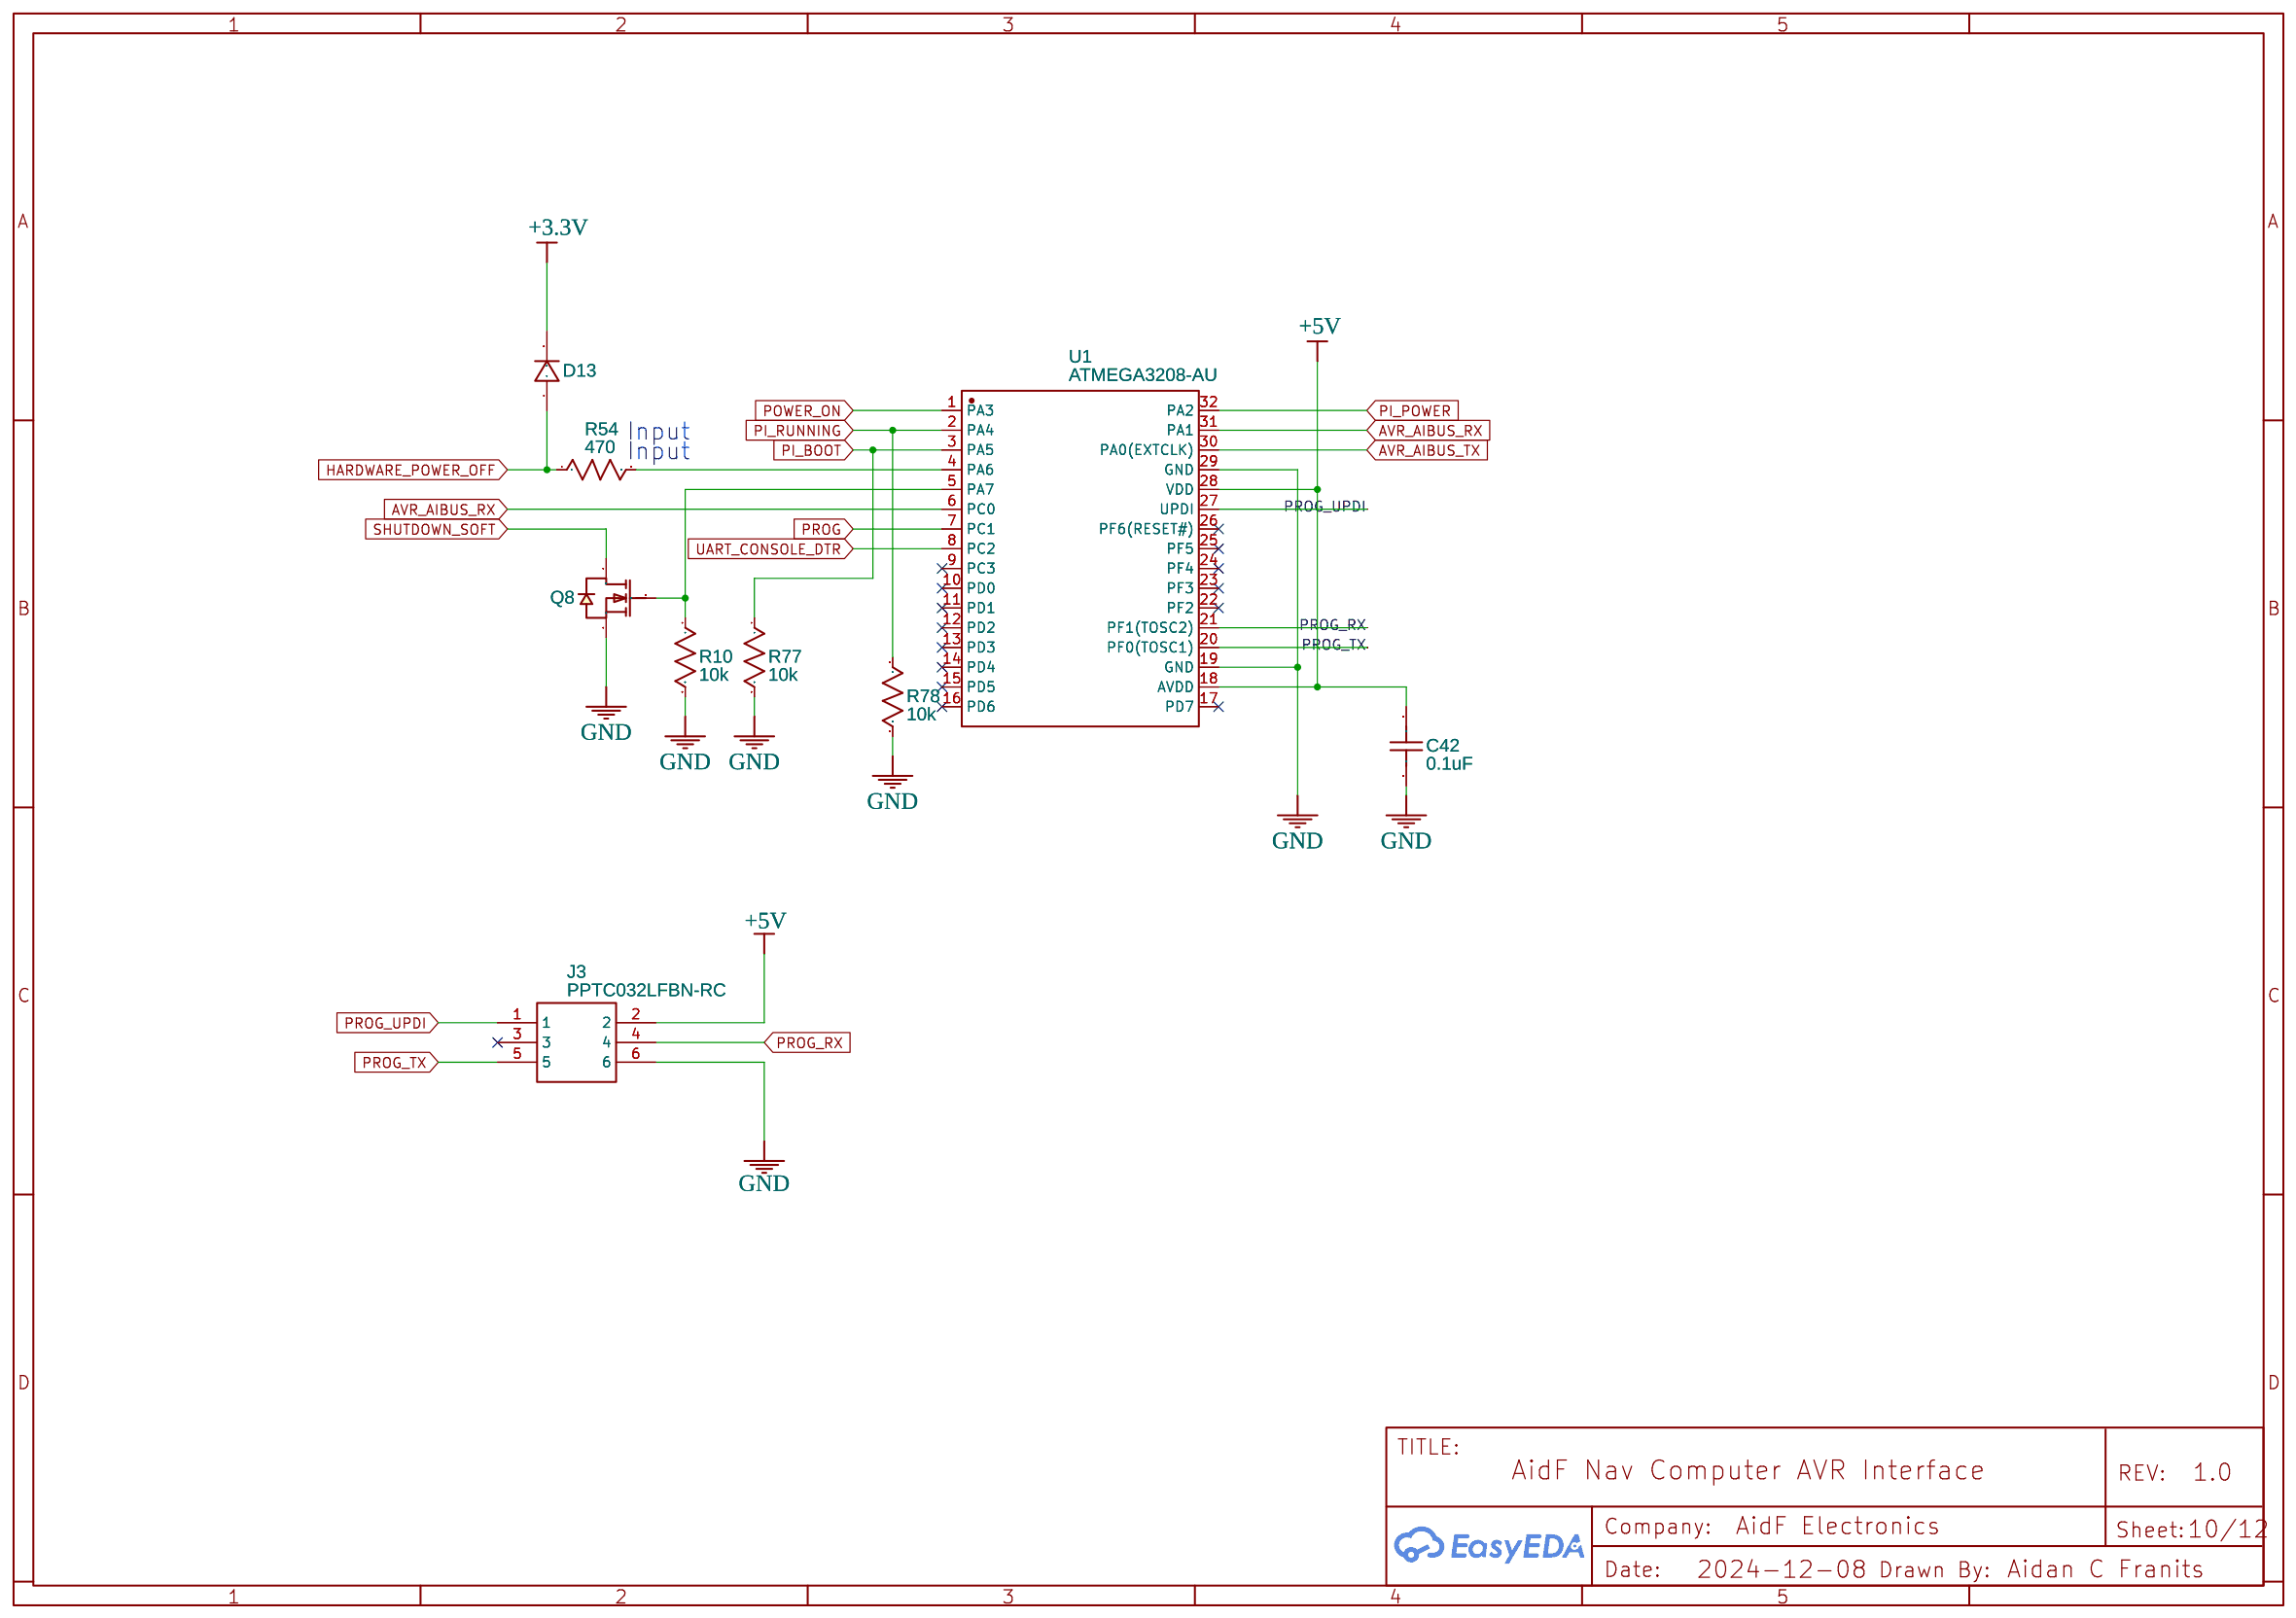
[diagram p9: AVR Interface]
11 SD Card: TITLE: AidF Nav Computer SD Card; Date: 2024-12-12; Sheet: 11/12
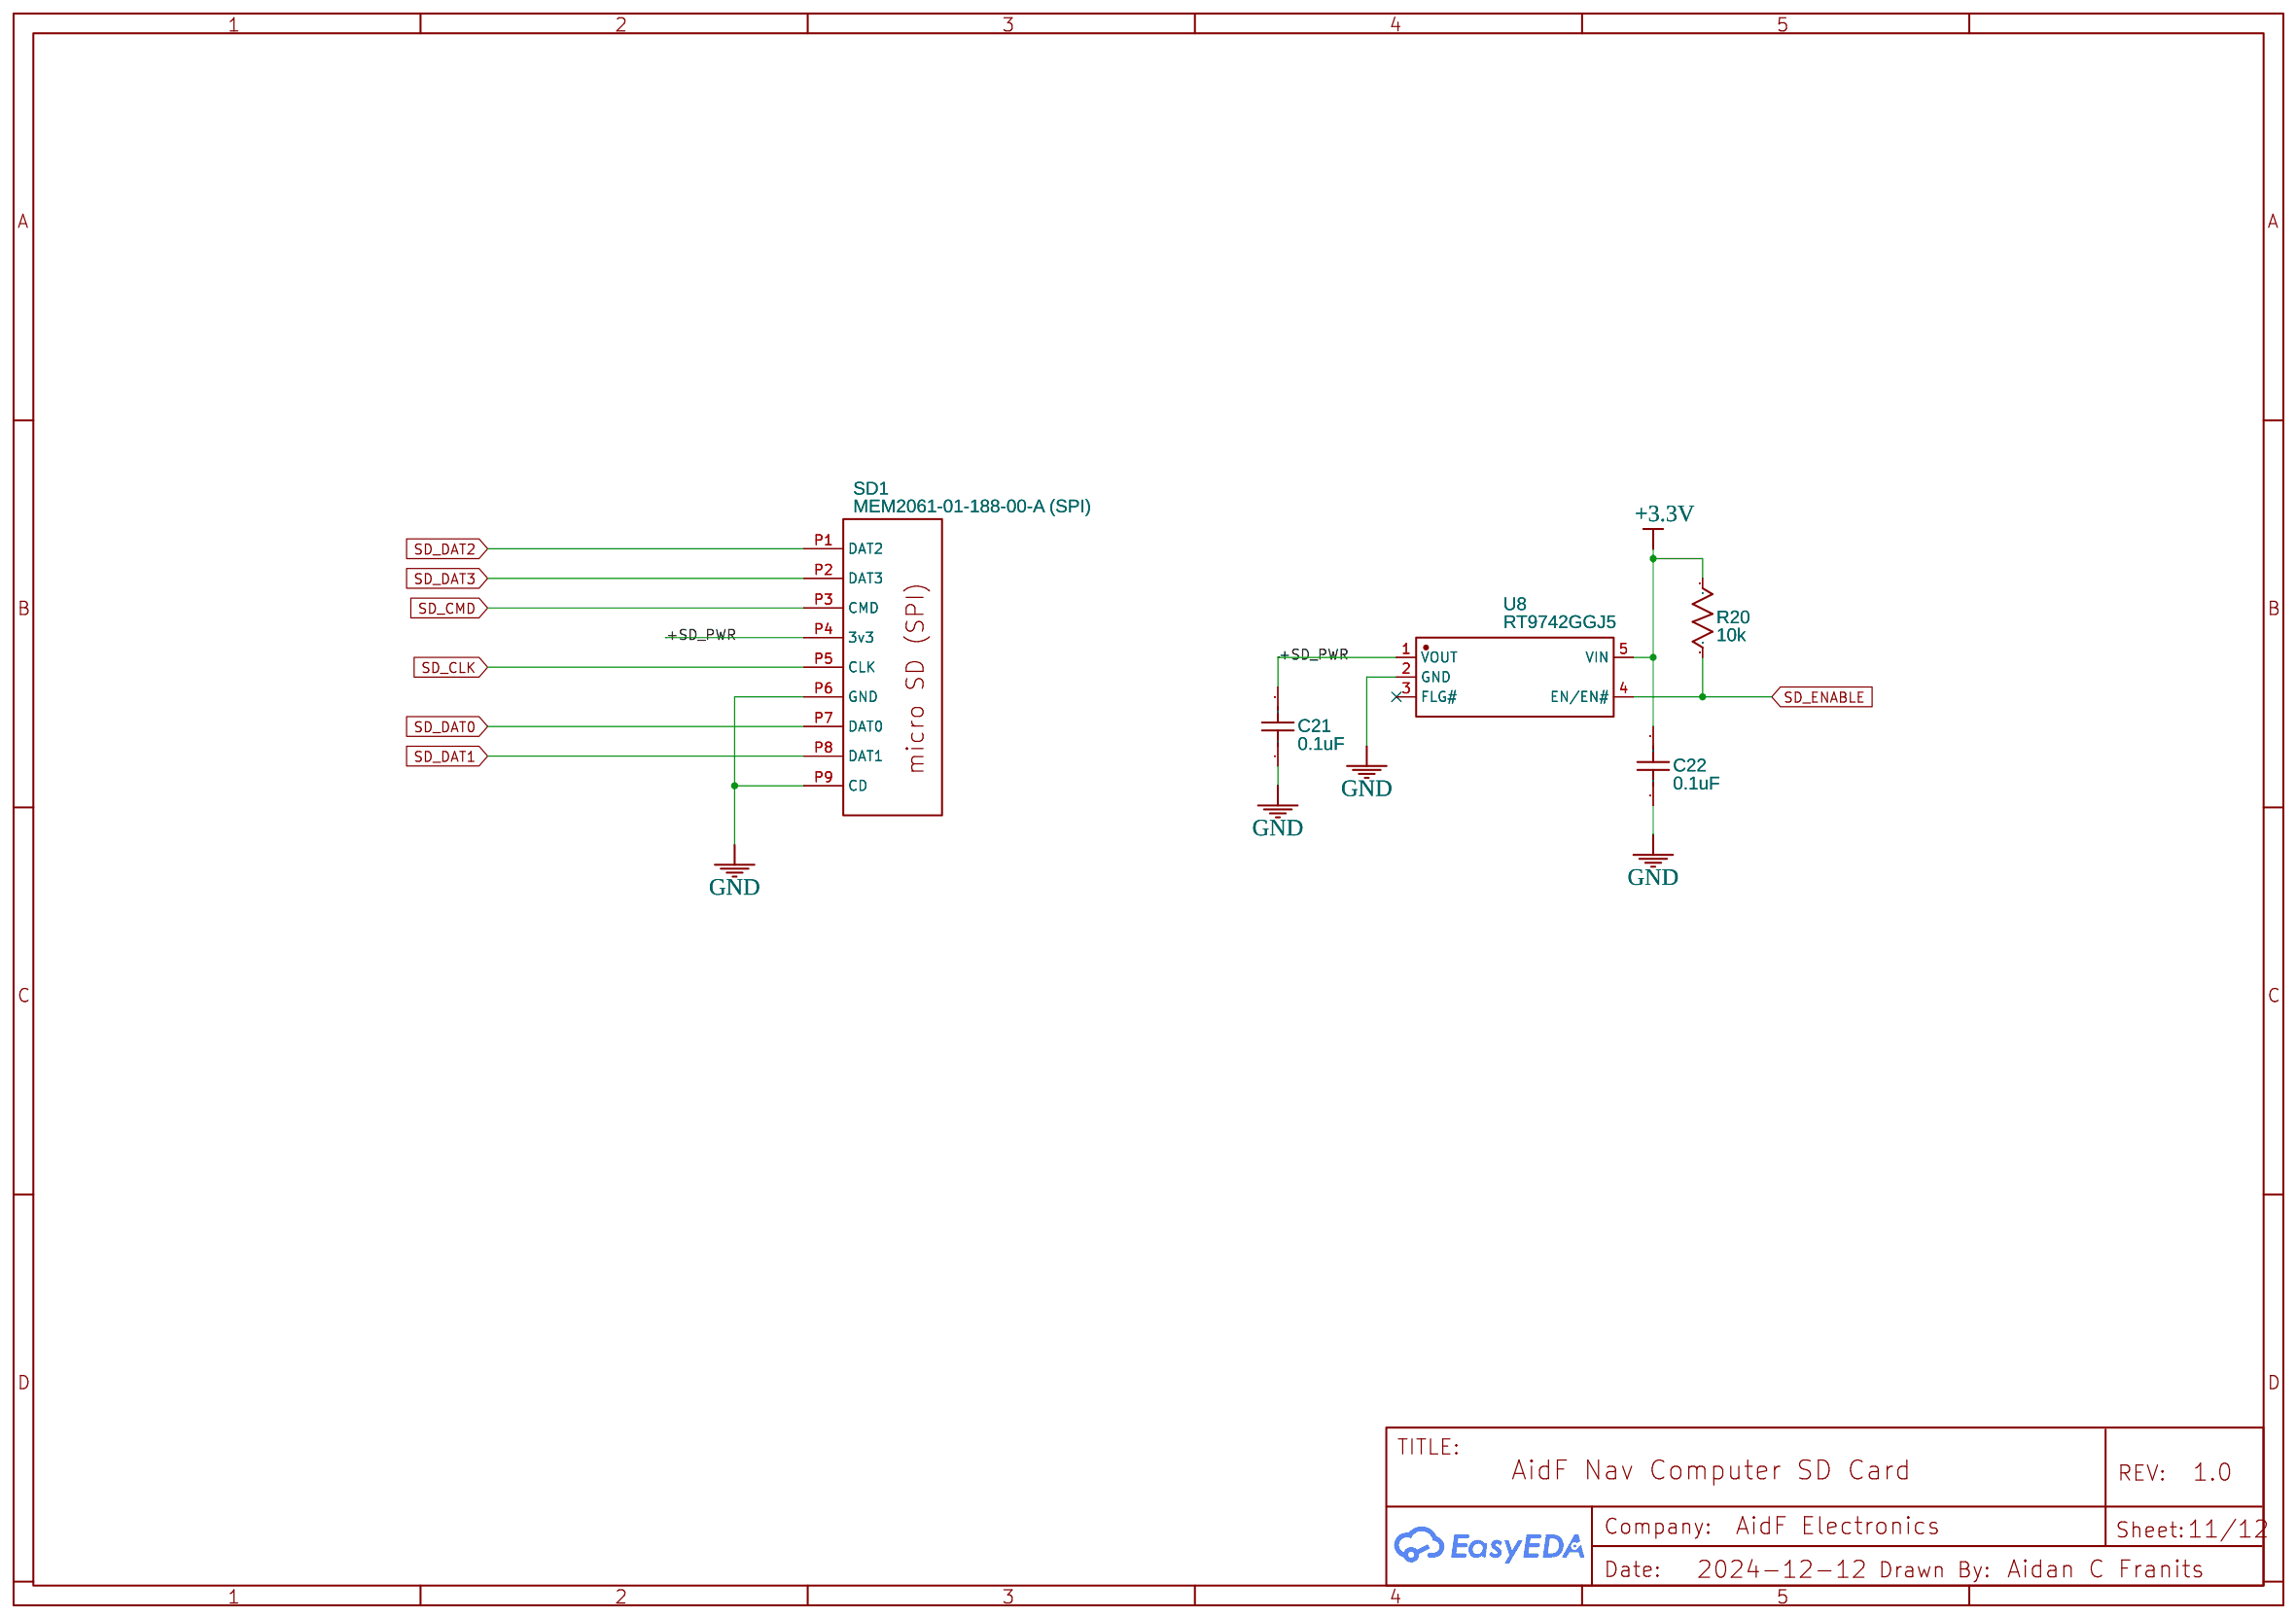
[diagram p10: SD Card]
12 HDMI Outlet: TITLE: AidF Nav Computer HDMI; Date: 2024-12-14; Sheet: 12/12
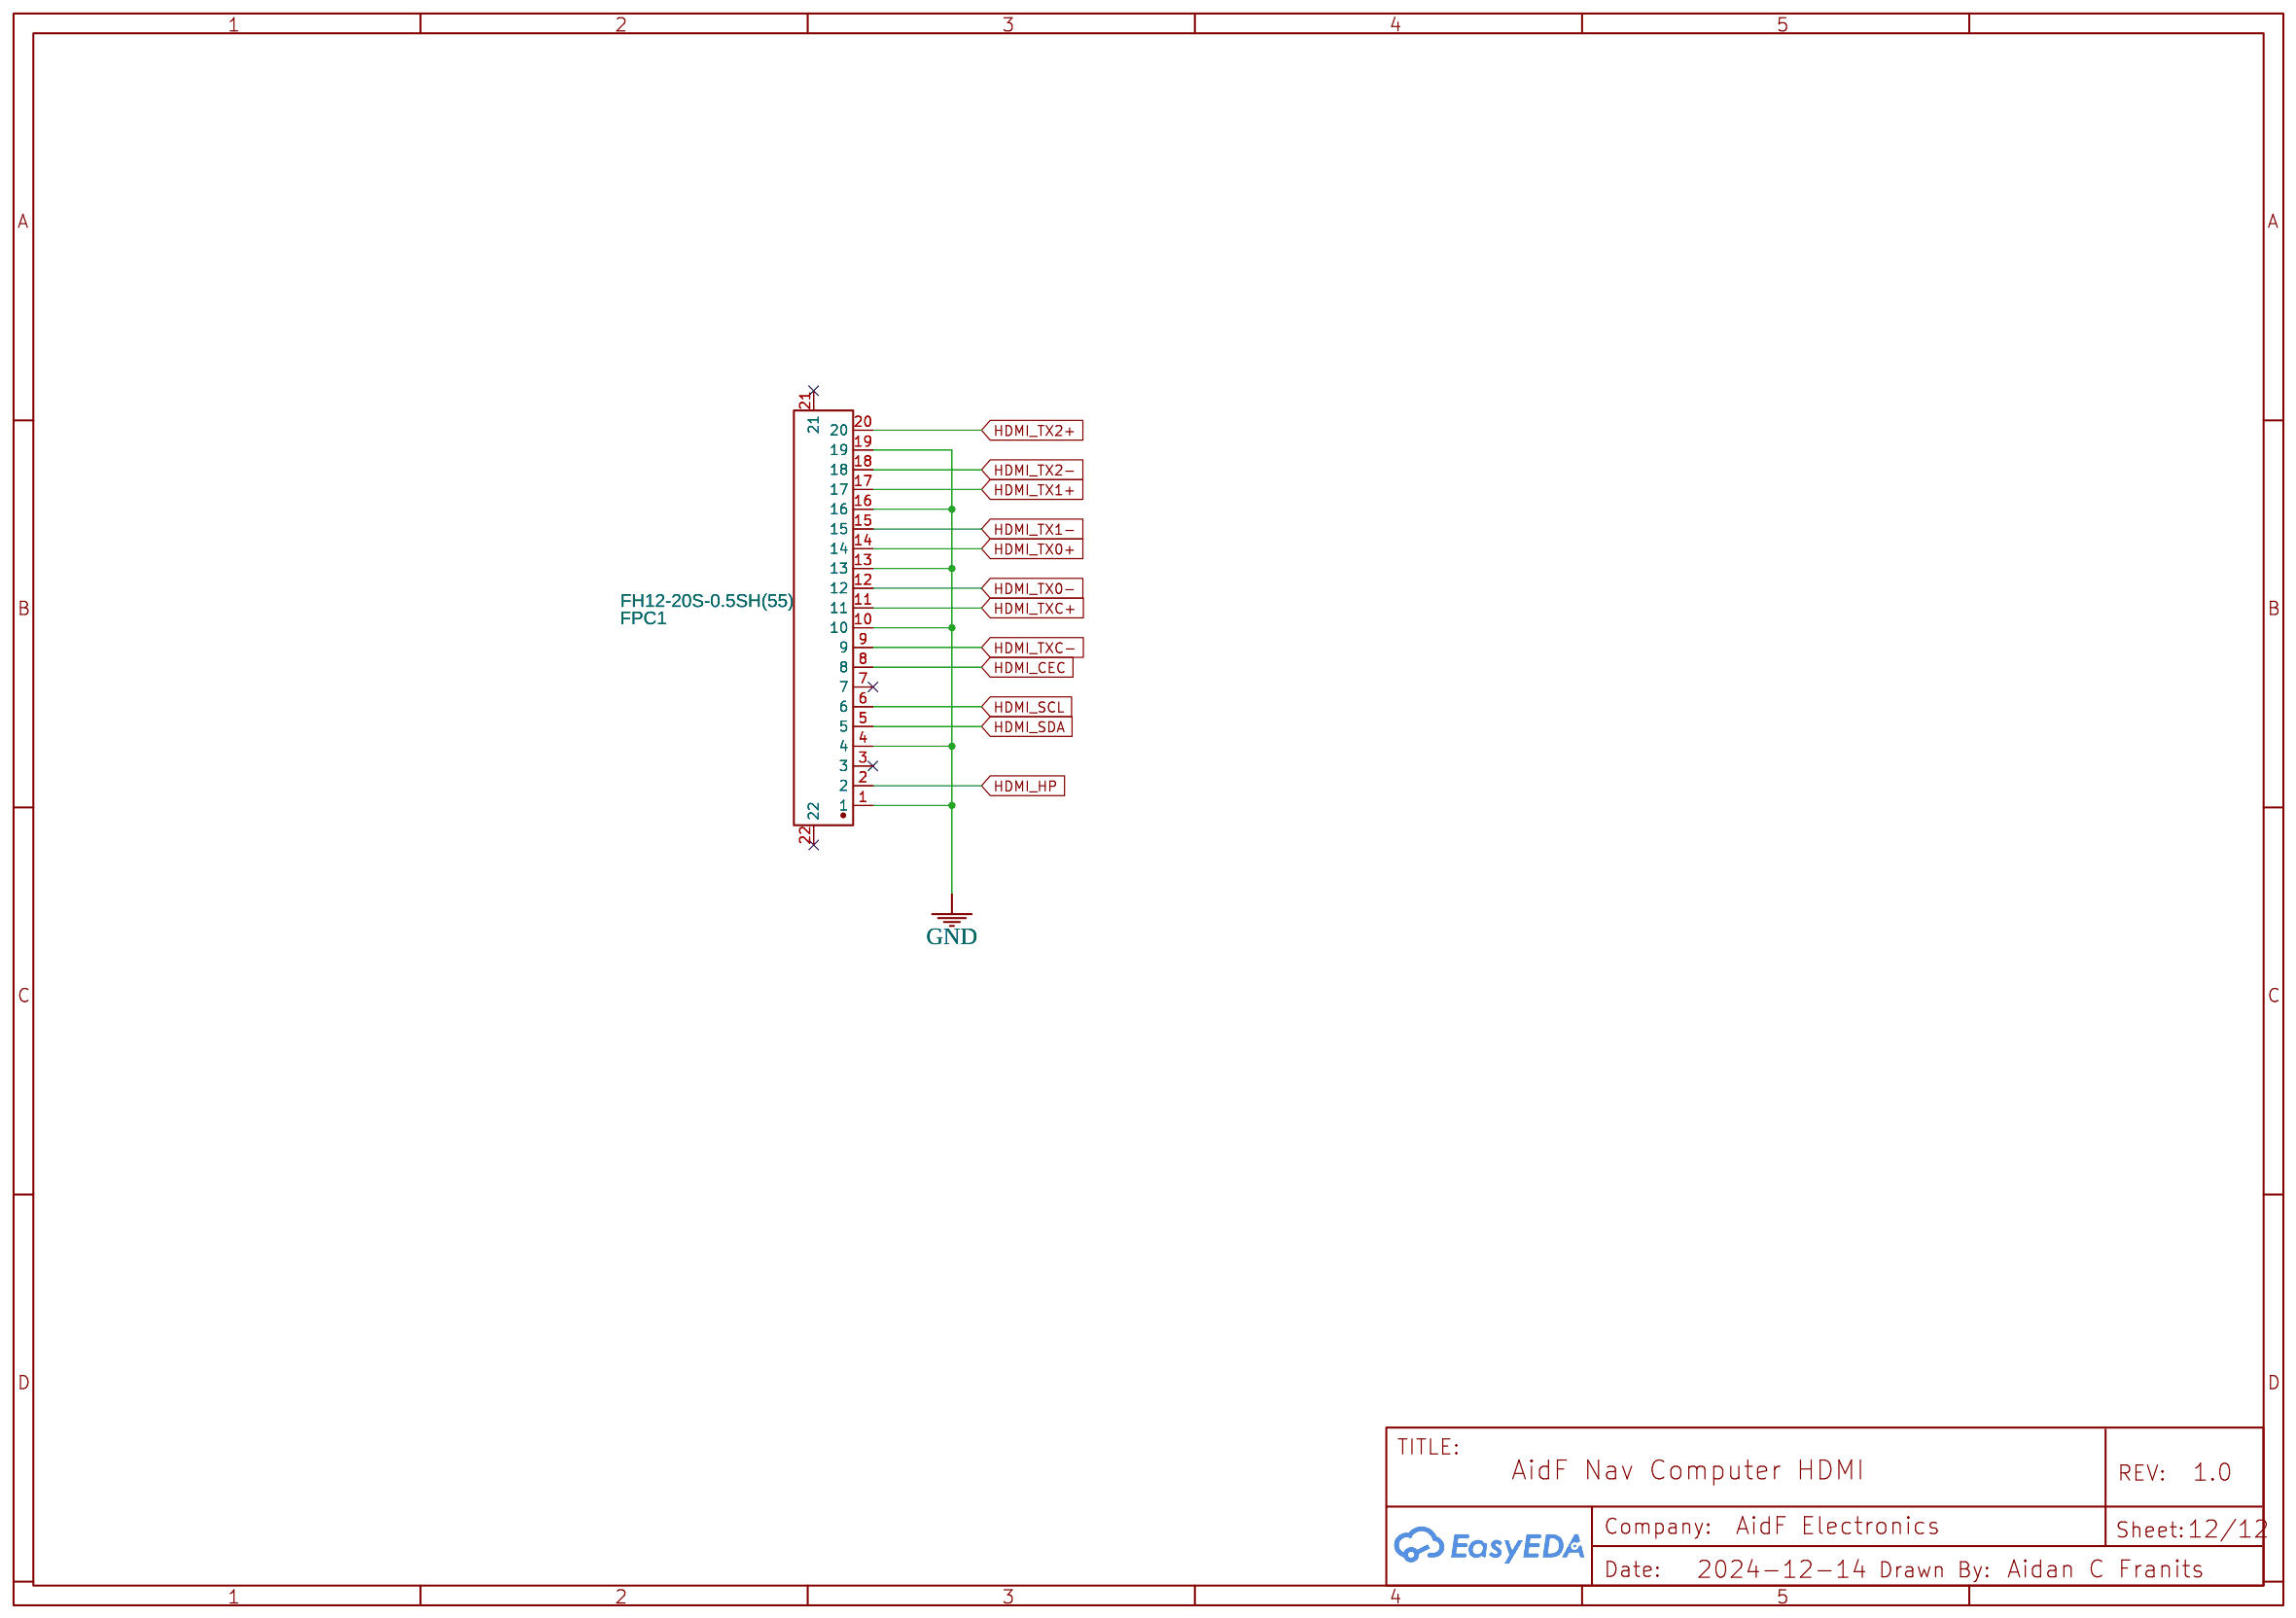
[diagram p11: HDMI Outlet]

## Parts
sheet AIBus Inlet
C13  0.1uF  [C0603]
C14  0.1uF  [C0603]
C18  0.1uF  [C0603]
C19  0.1uF  [C0603]
C72  0.1uF  [C0603]
D6  SD103AWS-TP  [SOD-323_L1.8-W1.3-LS2.6-FD]
D7  SD103AWS-TP  [SOD-323_L1.8-W1.3-LS2.6-FD]
R3  10k  [R0603]
R4  470  [R0603]
R5  470  [R0603]
R7  100  [R0603]
R8  10k  [R0603]
R9  10k  [R0603]
R11  10k  [R0603]
R12  10k  [R0603]
R79  10k  [R0603]
U2  SN74LVC2G04DBVR_C19829671  [SOT-23-6_L2.9-W1.6-P0.95-LS2.8-BR]
U3  MCP2561  [SOIC-8_L4.9-W3.9-P1.27-LS6.0-BL-2]
U4  74LVC1G332GW,125  [SOT-363_L2.0-W1.3-P0.65-LS2.1-BL]
U5  MCP2562  [SOIC-8_L4.9-W3.9-P1.27-LS6.0-BL-2]
sheet Analog Audio Processor
C45  0.1uF  [C0603]
C46  0.1uF  [C0603]
C58  0.1uF  [C0603]
C59  330p  [C0603]
C60  10uF  [C0805]
C61  0.1uF  [C0603]
C62  330p  [C0603]
C63  10uF  [C0805]
C64  0.1uF  [C0603]
C65  10uF  [C0805]
C66  10uF  [C0805]
C67  10uF  [C0805]
D16  SD103AWS-TP  [SOD-323_L1.8-W1.3-LS2.6-FD]
Q19  DMN67D8LW-13  [SOT-323-3_L2.2-W1.3-P1.30-LS2.1-BR]
R41  10k  [R0603]
R42  20k  [R0603]
R43  20k  [R0603]
R44  10k  [R0603]
R45  10k  [R0603]
R46  10k  [R0603]
R59  10k  [R0603]
R60  20k  [R0603]
R61  10k  [R0603]
R62  20k  [R0603]
R63  100k  [R0603]
R64  100k  [R0603]
R65  100k  [R0603]
R81  470  [R0603]
U17  LM2904BAQDRQ1  [SOIC-8_L4.9-W3.9-P1.27-LS6.0-BL]  (sections 1,2)
U24  MCP4251T-103E/SL  [SOIC-14_L8.7-W3.9-P1.27-LS6.0-BL]
U25  TL062VD  [SO-8_L4.9-W3.9-P1.27-LS6.0-BL]  (sections 1,2)
U26  MCP6006T-E/OT  [SOT-23-5_L2.9-W1.6-P0.95-LS2.8-BR]
sheet AVR Interface
C42  0.1uF  [C0603]
D13  SD103AWS-TP  [SOD-323_L1.8-W1.3-LS2.6-FD]
J3  PPTC032LFBN-RC  [RHDR6W75P254_2X3_812X508X850P]
Q8  DMN67D8LW-13  [SOT-323-3_L2.2-W1.3-P1.30-LS2.1-BR]
R10  10k  [R0603]
R54  470  [R0603]
R77  10k  [R0603]
R78  10k  [R0603]
U1  ATMEGA3208-AU  [TQFP-32_L7.0-W7.0-P0.80-LS9.0-BL]
sheet Carplay Interface
C16  0.1uF  [C0603]
U6  MFI337S3959  [USON-8_L2.5-W2.5-P0.50-BL-EP]
sheet Digital Audio Processor
C15  0.1uF  [C0603]
C28  0.1uF  [C0603]
C33  0.1uF  [C0603]
C34  0.1uF  [C0603]
C35  2.2uF  [C0603]
C36  2.2uF  [C0603]
C37  1uF  [C0603]
C38  1uF  [C0603]
R27  100k  [R0603]
R28  100k  [R0603]
R73  10k  [R0603]
R74  10k  [R0603]
U13  PCM5101APWR  [TSSOP-20_L6.5-W4.4-P0.65-LS6.5-BL]
sheet HDMI Outlet
FPC1  FH12-20S-0.5SH(55)  [FPC-SMD_FH12-20S-0.5SH-55]
sheet Mic ADC
C20  0.1uF  [C0603]
C52  0.1uF  [C0603]
C53  1uF  [C0603]
C54  1uF  [C0603]
C55  0.1uF  [C0603]
C73  0.1uF  [C0603]
J5  HDR-M-2.54_1x2  [HDR-M-2.54_1X2]
U7  12.288MHZ  [OSC-SMD_4P-L2.5-W2.0-BL-1]
U21  PCM1808PWR  [TSSOP-14_L5.0-W4.4-P0.65-LS6.4-BL]
sheet Pi Interface
C11  100u  [CAP-D6.3×F2.5]
C12  0.1uF  [C0603]
CN1  DF40C-100DS-0.4V(51)  [CONN-SMD_100P-P0.40_X0408FVS-100F-LPV01]
CN2  DF40C-100DS-0.4V(51)  [CONN-SMD_100P-P0.40_X0408FVS-100F-LPV01]
D9  SD103AWS-TP  [SOD-323_L1.8-W1.3-LS2.6-FD]
J6  HDR-M-2.54_2x3  [HDR-M-2.54_2X3]
R6  27  [R0603]
R51  27  [R0603]
R53  1.5k  [R0603]
sheet Power Inlet
C1  100u  [CAP-D6.3×F2.5]
C2  100u  [CAP-D6.3×F2.5]
C3  0.1uF  [C0603]
C4  0.1uF  [C0603]
C5  100u  [CAP-D6.3×F2.5]
C6  100u  [CAP-D6.3×F2.5]
C7  0.1uF  [C0603]
C8  0.1uF  [C0603]
C9  100u  [CAP-D6.3×F2.5]
C10  0.1uF  [C0603]
D1  5.6V  [SOD-123_L2.7-W1.6-LS3.7-RD-A]
D2  3.6V  [SOD-123_L2.7-W1.6-LS3.7-RD-A]
D3  6.8V  [SOD-123_L2.7-W1.6-LS3.7-RD-A]
D4  6.8V  [SOD-123_L2.7-W1.6-LS3.7-RD-A]
D5  5.6V  [SOD-123_L2.7-W1.6-LS3.7-RD-A]
D8  PROG  [LED0805-RD]
D14  ACTIVITY  [LED-TH_BD5.0-P2.54-FD]
D15  POWER  [LED-TH_BD5.0-P2.54-FD]
J1  HDR-M-2.54_1x10  [HDR-M-2.54_1X10]
J2  HDR-M-2.54_1x8  [HDR-M-2.54_1X8]
J4  HDR-M-2.54_1x10  [HDR-M-2.54_1X10]
J7  HDR-M-2.54_1x8  [HDR-M-2.54_1X8]
Q1  SI2347DS-T1-GE3  [SOT-23-3_L2.9-W1.3-P1.83-LS2.4-BR-1]
Q2  SI2347DS-T1-GE3  [SOT-23-3_L2.9-W1.3-P1.83-LS2.4-BR-1]
Q3  SI2347DS-T1-GE3  [SOT-23-3_L2.9-W1.3-P1.83-LS2.4-BR-1]
Q4  2N7002  [SOT-23_L2.9-W1.3-P0.95-LS2.4-BR]
Q5  SI2347DS-T1-GE3  [SOT-23-3_L2.9-W1.3-P1.83-LS2.4-BR-1]
Q6  DMN67D8LW-13  [SOT-23_L2.9-W1.3-P0.95-LS2.4-BR]
Q7  SI2347DS-T1-GE3  [SOT-23-3_L2.9-W1.3-P1.83-LS2.4-BR-1]
Q22  DMN67D8LW-13  [SOT-23_L2.9-W1.3-P0.95-LS2.4-BR]
Q23  DMN67D8LW-13  [SOT-23_L2.9-W1.3-P0.95-LS2.4-BR]
R1  10k  [R0603]
R2  10k  [R0603]
R35  150  [R0603]
R36  1k  [R0603]
R37  5.1k  [R0603]
R38  5.1k  [R0603]
R55  10k  [R0603]
R57  150  [R0603]
R58  150  [R0603]
R69  10k  [R0603]
R70  10k  [R0603]
R72  10k  [R0603]
SW1  OS102011MS2QN1  [SW-TH_OS102011MS2QN1]
U22  SN74LVC2G14DCKR  [SC-70-6_L2.0-W1.3-P0.65-LS2.2-BL]
USB1  USB4105-GF-A  [TYPE-C-SMD_SBC-160S1A-20-S412]
sheet Power Switches
L1  1u  [L0603]
L2  1u  [L0603]
L3  1u  [L0603]
L4  1u  [L0603]
L5  1u  [L0603]
L6  1u  [L0603]
L8  1u  [L0603]
L9  1u  [L0603]
L10  1u  [L0603]
Q16  DMN67D8LW-13  [SOT-323-3_L2.2-W1.3-P1.30-LS2.1-BR]
Q17  SI2347DS-T1-GE3  [SOT-23-3_L2.9-W1.3-P1.83-LS2.4-BR-1]
R16  10k  [R0603]
R17  10k  [R0603]
R18  10k  [R0603]
R31  10k  [R0603]
sheet SD Card
C21  0.1uF  [C0603]
C22  0.1uF  [C0603]
R20  10k  [R0603]
SD1  MEM2061-01-188-00-A (SPI)  [MEM2061-01-188-00-A]
U8  RT9742GGJ5  [TSOT-23-5_L2.9-W1.6-P0.95-LS2.8-BR]
sheet USB Inlet/Switch
C17  0.1uF  [C0603]
C27  1nF  [C0603]
C41  0.1uF  [C0603]
C43  0.1uF  [C0603]
C44  1uF  [C0603]
C47  0.1uF  [C0603]
C48  0.1uF  [C0603]
C49  1uF  [C0603]
C50  0.1uF  [C0603]
C51  18pF  [C0603]
C68  18pF  [C0603]
C69  0.1uF  [C0603]
C70  0.1uF  [C0603]
C71  0.1uF  [C0603]
C74  0.1uF  [C0603]
C75  0.1uF  [C0603]
C76  0.1uF  [C0603]
C77  1uF  [C0603]
R19  100k  [R0603]
R22  100k  [R0603]
R23  100k  [R0603]
R30  12k  [R0603]
R32  27  [R0603]
R34  27  [R0603]
R39  27  [R0603]
R40  27  [R0603]
R47  27  [R0603]
R48  27  [R0603]
R49  27  [R0603]
R50  27  [R0603]
R52  100k  [R0603]
U9  USB2514B-AEZC  [TQFN-36_L6.0-W6.0-P0.50-BL-EP3.7]
U10  FT231XS-R  [SSOP-20_L8.6-W3.9-P0.64-LS6.0-BL]
U11  FSUSB42MUX  [MSOP-10_L3.0-W3.0-P0.50-LS5.0-BL]
U14  FSUSB42MUX  [MSOP-10_L3.0-W3.0-P0.50-LS5.0-BL]
X3  24MHz  [CRYSTAL-SMD_4P-L2.0-W1.6-BL-B]

## Library data of the parts
C3 C4 C7 C8 C10 C12-C22 C28 C33 C34 C41-C43 C45-C48 C50 C52 C55 C58 C61 C64 C69-C76 = C_0603_US: Supplier Part: 1292-1392-1-ND; Supplier: Digi-Key; Contributor: LCEDA_Lib; Manufacturer Part: 0603B104K101CT; Manufacturer: Walsin Technology Corporation
D6 D7 D9 D13 D16 = 1N4148: Supplier: Digi-Key; Supplier Part: SD103AWSTPMSCT-ND; Manufacturer: Micro Commercial Co; Contributor: LCSC
R1-R3 R8-R12 R16-R18 R20 R31 R41 R44-R46 R55 R59 R61 R69 R70 R72-R74 R77-R79 = R_0603_US: Supplier Part: RNCP0603FTD10K0CT-ND; Supplier: Digi-Key; Contributor: LCEDA_Lib; Manufacturer Part: RNCP0603FTD10K0; Manufacturer: Stackpole Electronics Inc
R4 R5 R54 R81 = R_0603_US: Supplier Part: 311-470GRCT-ND; Supplier: Digi-Key; Contributor: LCEDA_Lib; Manufacturer Part: RC0603JR-07470RL; Manufacturer: YAGEO
R7 = R_0603_US: Supplier Part: P100HCT-ND; Supplier: Digi-Key; Contributor: LCEDA_Lib; Manufacturer Part: ERJ-3EKF1000V; Manufacturer: Panasonic Electronic Components
U2 = SN74LVC2G04DBVR_C19829671: Supplier: Digi-Key; Supplier Part: 296-13261-1-ND; Manufacturer: Texas Instruments; Manufacturer Part: SN74LVC2G04DBVR; Contributor: lcsc; JLCPCB Part Class: Extended Part
U3 = MCP2551T-I/SN: Supplier: Digi-Key; Manufacturer: Microchip Technology; Manufacturer Part: MCP2561T-E/SN; Supplier Part: MCP2561T-E/SNCT-ND; JLCPCB Part Class: Extended Part
U4 = 74LVC1G332GW,125: Contributor: LCSC; Supplier: Digi-Key; Supplier Part: 1727-6979-1-ND; Manufacturer: Nexperia USA Inc.; JLCPCB Part Class: Extended Part
U5 = MCP2551T-I/SN: Supplier: Digi-Key; Manufacturer: Microchip Technology; Manufacturer Part: MCP2562-E/SN; Supplier Part: MCP2562-E/SN-ND; JLCPCB Part Class: Extended Part
C59 C62 = C_0603_US: Supplier Part: 478-KGM15ACG1H331FTCT-ND; Supplier: Digi-Key; Contributor: LCEDA_Lib; Manufacturer Part: KGM15ACG1H331FT; Manufacturer: KYOCERA AVX
C60 C63 C65-C67 = C_0603_US: Supplier Part: 1276-2891-1-ND; Supplier: Digi-Key; Contributor: LCEDA_Lib; Manufacturer Part: CL21A106KAYNNNE; Manufacturer: Samsung Electro-Mechanics
Q8 Q16 Q19 = 2N7002: Supplier: Digi-Key; Manufacturer: Diodes Incorporated; Supplier Part: DMN67D8LW-13DICT-ND; Contributor: LCEDA_Lib
R42 R43 R60 R62 = R_0603_US: Supplier Part: P20.0KHCT-ND; Supplier: Digi-Key; Contributor: LCEDA_Lib; Manufacturer Part: ERJ-3EKF2002V; Manufacturer: Panasonic Electronic Components
R19 R22 R23 R27 R28 R52 R63-R65 = R_0603_US: Supplier Part: 311-100KHRCT-ND; Supplier: Digi-Key; Contributor: LCEDA_Lib; Manufacturer Part: RC0603FR-07100KL; Manufacturer: YAGEO
U17 = LM2904BAQDRQ1: subpart_no: 1; Supplier: Digi-Key; Supplier Part: 296-LM2904BIDRCT-ND; Manufacturer: Texas Instruments; Manufacturer Part: LM2904BIDR; JLCPCB Part Class: Extended Part
U24 = MCP4251T-103E/SL: Contributor: lcsc; Supplier: Digi-Key; Supplier Part: MCP4251T-103E/SLCT-ND; Manufacturer: Microchip Technology; JLCPCB Part Class: Extended Part
U25 = TL062VD: subpart_no: 1; Supplier: Digi-Key; Supplier Part: 296-1281-1-ND; Manufacturer: Texas Instruments; Manufacturer Part: TL062CDR
U26 = MCP6006T-E/OT: Supplier: Digi-Key; Manufacturer: Microchip Technology; Contributor: lcsc; JLCPCB Part Class: Extended Part
J3 = PPTC032LFBN-RC: Contributor: achinya_m; Supplier: Digi-Key; Supplier Part: S7071-ND; Manufacturer: Sullins Connector Solutions
U1 = ATMEGA3208-AU: Contributor: lcsc; Supplier: Digi-Key; Supplier Part: ATMEGA3208-AFRCT-ND; Manufacturer: Microchip Technology; JLCPCB Part Class: Extended Part
U6 = MFI337S3959: Contributor: LCSC; Supplier: LCSC; Supplier Part: C2837233; Manufacturer: null; JLCPCB Part Class: Extended Part
C35 C36 = C_0603_US: Supplier Part: 490-10731-1-ND; Supplier: Digi-Key; Contributor: LCEDA_Lib; Manufacturer Part: GRM188R61E225KA12D; Manufacturer: Murata Electronics
C37 C38 C44 C49 C53 C54 C77 = C_0603_US: Supplier Part: 311-1445-1-ND; Supplier: Digi-Key; Contributor: LCEDA_Lib; Manufacturer Part: CC0603KRX5R8BB105; Manufacturer: YAGEO
U13 = PCM5101APWR: Contributor: LCSC; Supplier: Digi-Key; Supplier Part: 296-36706-1-ND; Manufacturer: Texas Instruments; JLCPCB Part Class: Extended Part
FPC1 = FH12-20S-0.5SH(55): Contributor: LCSC; Supplier: Digi-Key; Supplier Part: HFJ120CT-ND; Manufacturer: Hirose Electric Co Ltd; JLCPCB Part Class: Extended Part
J5 = HDR-M-2.54_1x2: Supplier Part: 2057-PH1-02-UA-ND; Supplier: Digi-Key; Manufacturer: Adam Tech; Manufacturer Part: PH1-02-UA; Contributor: LCEDA_Lib
U7 = CSX-252FAE16934400T: Contributor: lcsc; Supplier: Digi-Key; Supplier Part: 478-KC2520Z12.2880C1KX00CT-ND; Manufacturer: KYOCERA AVX; Manufacturer Part: KC2520Z12.2880C1KX00; JLCPCB Part Class: Extended Part
U21 = PCM1808PWR: Supplier: Digi-Key; Manufacturer: Texas Instruments; Supplier Part: 296-26307-1-ND; JLCPCB Part Class: Extended Part
C1 C2 C5 C6 C9 C11 = CE_TH_D6.3×F2.5_US: Supplier Part: 399-6650-1-ND; Supplier: Digi-Key; Contributor: LCEDA_Lib; Manufacturer Part: ESK107M025AE3EA; Manufacturer: KEMET
CN1 CN2 = HC-PBB40C-100DS-0.4V-3.0-02: Supplier: Digi-Key; Supplier Part: H11615CT-ND; Manufacturer: Hirose Electric Co Ltd; Contributor: lcsc; JLCPCB Part Class: Extended Part
J6 = HDR-M-2.54_2x3: Supplier Part: 952-2121-ND; Supplier: Digi-Key; Manufacturer: Harwin Inc.; Manufacturer Part: M20-9980346; Contributor: LCEDA_Lib
R6 R32 R34 R39 R40 R47-R51 = R_0603_US: Supplier Part: 311-27.0HRCT-ND; Supplier: Digi-Key; Contributor: LCEDA_Lib; Manufacturer Part: RC0603FR-0727RL; Manufacturer: YAGEO
R53 = R_0603_US: Supplier Part: 311-1.5KGRCT-ND; Supplier: Digi-Key; Contributor: LCEDA_Lib; Manufacturer Part: RC0603JR-071K5L; Manufacturer: YAGEO
D1 D5 = BZT52C12-TP: Contributor: LCSC; Supplier: Digi-Key; Supplier Part: MMSZ5232BT1GOSCT-ND; Manufacturer: onsemi; Manufacturer Part: MMSZ5232BT1G; JLCPCB Part Class: Extended Part
D2 = BZT52C12-TP: Contributor: LCSC; Supplier: Digi-Key; Supplier Part: MMSZ4685-TPMSCT-ND; Manufacturer: Micro Commercial Co; Manufacturer Part: MMSZ4685-TP; JLCPCB Part Class: Extended Part
D3 D4 = BZT52C12-TP: Contributor: LCSC; Supplier: Digi-Key; Supplier Part: MMSZ4692T1GOSCT-ND; Manufacturer: onsemi; Manufacturer Part: MMSZ4692T1G; JLCPCB Part Class: Extended Part
D8 = LTST-C171KGKT: Contributor: LCSC; Supplier: Digi-Key; Manufacturer: Lite-On Inc.; Supplier Part: 160-1426-1-ND; JLCPCB Part Class: Extended Part
D14 = -: catid: 20; Manufacturer Part: LTL-4233; Supplier: Digi-Key; Supplier Part: 160-1130-ND; Manufacturer: Lite-On Inc.
D15 = -: catid: 20; Manufacturer Part: LTL-4273; Supplier: Digi-Key; Supplier Part: 160-1966-ND; Manufacturer: Lite-On Inc.
J1 J4 = HDR-M-2.54_1x10: Supplier Part: 2057-PH1-10-UA-ND; Supplier: Digi-Key; Manufacturer: Adam Tech; Manufacturer Part: PH1-10-UA; Contributor: LCEDA_Lib
J2 J7 = HDR-M-2.54_1x8: Supplier Part: 2057-PH1-08-UA-ND; Supplier: Digi-Key; Manufacturer: Adam Tech; Manufacturer Part: PH1-08-UA; Contributor: LCEDA_Lib
Q1-Q3 Q5 Q7 Q17 = IRF5210: Supplier: Digi-Key; Manufacturer: Vishay Siliconix; Supplier Part: SI2347DS-T1-GE3CT-ND; Contributor: LCEDA_Lib
Q4 = 2N7002: Supplier: Digi-Key; Manufacturer: Diodes Incorporated; Manufacturer Part: DMN3404L-7; image: //image.lceda.cn/szlcsc/C65189.jpg; Supplier Part: DMN3404LDICT-ND; Paste Type: expand; Contributor: LCEDA_Lib
Q6 Q22 Q23 = 2N7002: Supplier: Digi-Key; Manufacturer: Diodes Incorporated; image: //image.lceda.cn/szlcsc/C65189.jpg; Supplier Part: DMN67D8LW-13DICT-ND; Paste Type: expand; Contributor: LCEDA_Lib
R35 R57 R58 = R_0603_US: Supplier Part: 311-150HRCT-ND; Supplier: Digi-Key; Contributor: LCEDA_Lib; Manufacturer Part: RC0603FR-07150RL; Manufacturer: YAGEO
R36 = R_0603_US: Supplier Part: 311-1.00KHRCT-ND; Supplier: Digi-Key; Contributor: LCEDA_Lib; Manufacturer Part: RC0603FR-071KL; Manufacturer: YAGEO
R37 R38 = R_0603_US: Supplier Part: 311-5.10KHRCT-ND; Supplier: Digi-Key; Contributor: LCEDA_Lib; Manufacturer Part: RC0603FR-075K1L; Manufacturer: YAGEO
SW1 = OS102011MS2QN1: Contributor: LCSC; Supplier: Digi-Key; Supplier Part: CKN9565-ND; Manufacturer: C&K; JLCPCB Part Class: Extended Part
U22 = SN74LVC2G14DCKR(UMW): Supplier: Digi-Key; Supplier Part: 296-13011-1-ND; Manufacturer: Texas Instruments; JLCPCB Part Class: Extended Part; Contributor: lcsc
USB1 = USB4105-GF-A: Contributor: lcsc; Supplier: Digi-Key; Supplier Part: 2073-USB4105-GF-ACT-ND; Manufacturer: GCT; JLCPCB Part Class: Extended Part
L1-L6 L8-L10 = L0603_US: Supplier Part: 445-174936-1-ND; Supplier: Digi-Key; Contributor: LCEDA_Lib; Manufacturer Part: MAF1608FAD151CT000; Manufacturer: TDK Corporation
SD1 = MEM2061-01-188-00-A (SPI): Manufacturer: GCT; Supplier: Digi-Key; Supplier Part: 2073-MEM2061-01-188-00-ACT-ND; Contributor: fjperez86; Part_L: https://www.digikey.com/product-detail/en/gct/MEM2061-01-188-00-A/2073-MEM2061-01-188-00-ACT-ND/9859683
U8 = RT9742GGJ5: Contributor: LCSC; Supplier: Digi-Key; Supplier Part: 1028-1436-1-ND; Manufacturer: Richtek USA Inc.; JLCPCB Part Class: Extended Part
C27 = C_0603_US: Supplier Part: 490-1451-1-ND; Supplier: Digi-Key; Contributor: LCEDA_Lib; Manufacturer Part: GRM1885C1H102JA01D; Manufacturer: Murata Electronics
C51 C68 = C_0603_US: Supplier Part: 712-QSCP251Q180J1GV001TCT-ND; Supplier: Digi-Key; Contributor: LCEDA_Lib; Manufacturer Part: 712-QSCP251Q180J1GV001TDKR-ND; Manufacturer: Johanson Technology Inc.
R30 = R_0603_US: Supplier Part: RMCF0603FT12K0CT-ND; Supplier: Digi-Key; Contributor: LCEDA_Lib; Manufacturer Part: RMCF0603FT12K0; Manufacturer: Stackpole Electronics Inc
U9 = USB2514B-AEZC: Contributor: lcsc; Supplier: Digi-Key; Supplier Part: 638-1122-ND; Manufacturer: Microchip Technology; JLCPCB Part Class: Extended Part
U10 = FT231XS-R: Contributor: LCSC; Supplier: Digi-Key; Manufacturer: FTDI, Future Technology Devices International Ltd; Supplier Part: 768-1129-1-ND; JLCPCB Part Class: Extended Part
U11 U14 = FSUSB42MUX: Supplier: Digi-Key; Manufacturer: onsemi; Supplier Part: FSUSB42MUXCT-ND; JLCPCB Part Class: Extended Part
X3 = XRCGB24M000F3M00R0: Contributor: LCSC; Supplier: Digi-Key; Manufacturer: Murata Electronics; Supplier Part: 490-5576-1-ND; JLCPCB Part Class: Extended Part

## Nets
2V5_REF: R17.2 R18.1 U26.3(VIN+)
+3.3V: C2.1 C4.2 C16.2 C22.2 C34.2 C47.2 C71.2 C72.2 C74.2 C75.2 D2.1(K) D6.2 D7.2 D13.2 D16.2 L1.1 L2.1 L6.1 Q2.2(S) R19.2 R20.1 R55.1 R57.2 R58.2 U5.5(VIO) U6.7(RST) U6.8(VCC) U8.5(VIN) U10.3(VCCIO) U10.14(RESET#) U11.1(VCC) U13.1(CPVDD) U14.1(VCC)
+3V3_IN: J1.2 Q2.3(D)
+5V: C1.1 C3.2 C13.2 C14.2 C18.2 C19.2 C42.2 D1.1(K) J3.2 L9.1 L10.1 Q1.2(S) Q17.2(S) R8.1 R9.1 R16.1 R17.1 R72.1 SW1.2 U1.18(AVDD) U1.28(VDD) U2.5(VCC) U3.3(VDD) U4.5(VCC) U5.3(VDD) U22.5(VCC)
+5V_IN: J1.1 Q1.3(D)
+5VA: C73.1 L9.2 U21.3(VCC)
+5VP: C11.1 C12.2 CN1.77 CN1.79 CN1.81 CN1.83 CN1.85 CN1.87 Q17.3(D) R22.2
+5VU: C76.2 C77.2 J4.1 J4.5 J7.1 J7.5 Q7.3(D) U10.15(VCC)
+5VU_IN: J1.4 Q5.3(D)
+5VU_US: C9.1 C10.2 D5.1(K) Q5.2(S) Q7.2(S) R1.2
+6V: C5.1 C7.2 D3.1(K) L5.1 Q3.2(S)
+6V_IN: J1.3 Q3.3(D)
+A6V: C45.1 L5.2 U17.8(V+) U25.8(VCC)
+AVDD: C41.2 C43.2 C44.2 L2.2 U9.5(VDDA33) U9.10(VDDA33) U9.29(VDDA33) U9.36(VDDA33)
+DVDD: C15.2 C20.2 C48.2 C49.2 C50.2 C52.2 L1.2 R52.1 R74.1 U7.4(Vdd) U9.15(VDD33) U9.23(VDD33) U13.20(DVDD) U21.4(VDD) U21.10(MD0) U21.11(MD1)
-6V: C6.2 C8.2 D4.2(A) L8.1 Q4.2(S)
-6V_IN: J1.6 Q4.3(D)
-A6V: C46.2 L8.2 U17.4(V-) U25.4(VEE)
AGND: C28.1 C45.2 C46.1 C58.2 C61.2 C64.2 C67.2 L3.2 R27.1 R28.1 R63.1 R64.1 U13.9(AGND) U17.3(IN1+) U17.5(IN2+) U21.2(AGND) U24.4(VSS) U26.2(VSS)
DGND: C15.1 C20.1 C33.1 C36.1 L4.2 R73.2 U7.2(GND) U13.10(DEMP) U13.16(FMT) U13.19(DGND) U21.5(DGND) U21.12(FMT)
GND: C1.2 C2.2 C3.1 C4.1 C5.2 C6.1 C7.1 C8.1 C9.2 C10.1 C11.2 C12.1 C13.1 C14.1 C16.1 C17.1 C18.1 C19.1 C21.1 C22.1 C27.1 C34.1 C41.1 C42.1 C43.1 C44.1 C47.1 C48.1 C49.1 C50.1 C51.1 C52.1 C55.2 C68.1 C69.1 C70.1 C71.1 C72.1 C73.2 C74.1 C75.1 C76.1 C77.1 CN1.1 CN1.2 CN1.7 CN1.8 CN1.13 CN1.14 CN1.22 CN1.23 CN1.32 CN1.33 CN1.42 CN1.43 CN1.52 CN1.53 CN1.59 CN1.60 CN1.65 CN1.66 CN1.71 CN1.74 CN1.98 CN2.7 CN2.8 CN2.13 CN2.14 CN2.19 CN2.20 CN2.25 CN2.26 CN2.31 CN2.32 CN2.37 CN2.38 CN2.44 CN2.50 CN2.55 CN2.56 CN2.61 CN2.62 CN2.67 CN2.68 CN2.73 CN2.74 CN2.79 CN2.80 CN2.85 CN2.86 CN2.91 CN2.92 CN2.97 CN2.98 D1.2(A) D2.2(A) D3.2(A) D4.1(K) D5.2(A) D8.1(K) FPC1.1 FPC1.4 FPC1.10 FPC1.13 FPC1.16 FPC1.19 J1.5 J1.7 J2.8 J3.6 J4.4 J4.8 J4.9 J5.2 J6.2 J6.4 J6.6 J7.4 J7.8 L3.1 L4.1 Q1.1(G) Q2.1(G) Q3.1(G) Q4.1(G) Q5.1(G) Q6.2(S) Q8.2(S) Q16.2(S) Q19.2(S) Q22.2(S) Q23.2(S) R2.2 R3.2 R10.2 R11.2 R12.2 R18.2 R23.1 R30.2 R31.2 R36.2 R37.2 R38.1 R41.2 R69.2 R70.2 R77.2 R78.2 R79.2 SD1.P6(GND) SD1.P9(CD) SW1.4 SW1.5 U1.19(GND) U1.29(GND) U2.2(GND) U3.2(VSS) U4.2(GND) U5.2(VSS) U6.1(GND) U6.9(EP) U8.2(GND) U9.11(TEST) U9.24(SCL/SMBCLK/CFG_SEL0) U9.25(HS_IND/CFG_SEL1) U9.37(VSS) U10.6(GND) U10.16(GND) U11.5(GND) U11.10(OE#) U13.3(CPGND) U14.5(GND) U14.10(OE#) U22.2(GND) USB1.1(EH) USB1.A1(GND) USB1.A12(GND) USB1.B1(GND) USB1.B12(GND)
VBUS_DET: C27.2 R22.1 R23.2 U9.27(VBUS_DET)
+AAVDD: C28.2 L6.2 U13.8(AVDD)
+BVDD: C58.1 L10.2 U24.11(WP#) U24.12(SHDN#) U24.14(VDD) U26.5(VDD)
+SD_PWR: C21.2 SD1.P4(3v3) U8.1(VOUT)
/FULL_POWER_ON: R12.1 U2.4(2Y) U3.8(RS)
/LED_ACTIVITY_GATE: CN1.21 R72.2 U22.3(A2)
/LED_POWER_GATE: CN1.95 U22.1(A1)
/PI_POWER: R3.1 U2.6(1Y) U5.8(RS)
AIBUS+: J1.8 R7.2 U3.7(CANH) U5.7(CANH)
AIBUS-: J1.9 R7.1 U3.6(CANL) U5.6(CANL)
ANA_AUDIO_OUT_L: C37.2 C60.2 R27.2
ANA_AUDIO_OUT_R: C38.2 C63.2 R28.2
AVR_AIBUS_RX: R9.2 U1.6(PC0) U1.31(PA1) U3.4(RXD)
AVR_AIBUS_TX: R8.2 U1.30(PA0(EXTCLK)) U3.1(TXD)
BIAS_CS: CN1.39 U24.1(CS#)
BIAS_IN_L: C59.2 R59.2 U24.7(P1A) U25.1(Output 1)
BIAS_IN_R: C62.2 R61.2 U24.8(P0A) U25.7(Output 2)
BT_OFF: CN1.91 J6.3
BUF_2V5: C61.1 C64.1 C67.1 R65.1 U24.5(P1B) U24.10(P0B) U25.3(Inputs 1+) U25.5(Inputs 2+)
CLK: CN1.38 U24.2(SCK)
CR_FILTER: C69.2 U9.14(CRFILT)
DAC_FILTER_MODE: CN1.45 R73.1 U13.11(FLT)
DAC_MUTE: CN1.50 R74.2 U13.17(XSMT)
FULL_POWER_ON: J1.10 R11.1 U2.3(2A) U4.4(Y)
HARDWARE_POWER_OFF: CN1.99 D13.1 R54.1
HDMI_CEC: CN2.51 FPC1.8
HDMI_HP: CN2.53 FPC1.2
HDMI_SCL: CN2.100 FPC1.6
HDMI_SDA: CN2.99 FPC1.5
HDMI_TX0+: CN2.82 FPC1.14
HDMI_TX0-: CN2.84 FPC1.12
HDMI_TX1+: CN2.76 FPC1.17
HDMI_TX1-: CN2.78 FPC1.15
HDMI_TX2+: CN2.70 FPC1.20
HDMI_TX2-: CN2.72 FPC1.18
HDMI_TXC+: CN2.88 FPC1.11
HDMI_TXC-: CN2.90 FPC1.9
I2C_CLK: CN1.80 U6.6(SCL)
I2C_DATA: CN1.82 U6.2(SDA)
MIC_IN: C53.1 C54.1 J5.1
NAV_MUTE: J2.7 Q19.3(D)
NAV_MUTE_GATE: CN1.31 Q19.1(G) R41.1
NAV_PROMPT_AUDIO+: J2.5 R46.1 U17.7(OUT2)
NAV_PROMPT_AUDIO-: J2.6 R44.2 R45.2 U17.1(OUT1)
NAV_PROMPT_AUDIO_L: C65.2 R42.1 R63.2
NAV_PROMPT_AUDIO_R: C66.1 R43.1 R64.2
PI_3V3_OUT: CN1.78 CN1.84 CN1.86 R53.2
PI_AIBUS_RX: CN1.51 D7.1 R5.1
PI_AIBUS_TX: CN1.55 D6.1 R4.1
PI_BOOT: CN1.100 R77.1 U1.3(PA5)
PI_I2S_BCK: CN1.49 J2.2 U13.13(BCK) U21.8(BCK)
PI_I2S_DIN: CN1.27 U21.9(DOUT)
PI_I2S_DOUT: CN1.25 J2.1 U13.14(DIN)
PI_I2S_LRCK: CN1.26 J2.3 U13.15(LRCK) U21.7(LRCK)
PI_I2S_SCK: J2.4 U7.3(OUTPUT) U13.12(SCK) U21.6(SCKI)
PI_IN_USB+: CN2.5 R51.2
PI_IN_USB-: CN2.3 R6.2
PI_POWER: Q16.1(G) R31.1 U1.32(PA2) U2.1(1A) U4.6(C)
PI_RUNNING: CN1.92 R78.1 U1.2(PA4)
PI_USB+: R51.1 R53.1 U11.3(D+)
PI_USB-: R6.1 U11.4(D-)
PICO: CN1.40 D16.1 R81.2
PLL_FILTER: C70.2 U9.34(PLLFILT)
POCI: CN1.44 U24.3(SDI)
POWER_ON: R79.1 U1.1(PA3) U4.1(A)
PRE_DAC_OUT_L: C37.1 U13.6(OUTL)
PRE_DAC_OUT_R: C38.1 U13.7(OUTR)
PROG: D9.2 R35.1 R36.1 SW1.1 U1.7(PC1) U4.3(B) U11.2(Sel) U14.2(Sel)
PROG_RX: J3.4 U1.21(PF1(TOSC2))
PROG_TX: J3.5 U1.20(PF0(TOSC1))
PROG_UPDI: J3.1 U1.27(UPDI)
SD_CLK: CN1.57 SD1.P5(CLK)
SD_CMD: CN1.62 SD1.P3(CMD)
SD_DAT0: CN1.63 SD1.P7(DAT0)
SD_DAT1: CN1.67 SD1.P8(DAT1)
SD_DAT2: CN1.69 SD1.P1(DAT2)
SD_DAT3: CN1.61 SD1.P2(DAT3)
SD_ENABLE: R20.2 U8.4(EN/EN#)
SERVER_BOOT: CN1.93 J6.5
SHUTDOWN_SOFT: CN1.56 Q8.3(D)
UART_CONSOLE_CTS: CN1.30 U10.9(CTS#)
UART_CONSOLE_DTR: U1.8(PC2) U10.1(DTR#)
UART_CONSOLE_RTS: CN1.37 U10.2(RTS#)
UART_CONSOLE_RX: CN1.54 U10.4(RXD)
UART_CONSOLE_TX: CN1.34 U10.20(TXD)
UART_USB+: U10.11(USBDP) U14.7(HSD1+)
UART_USB-: U10.12(USBDM) U14.6(HSD1-)
USB1+: R34.2 U9.2(USBDP_DN1/PRT_DIS_P1)
USB1-: R32.2 U9.1(/USBDM_DN1/PRT_DIS_M1)
USB1_D+: J4.3 R34.1
USB1_D-: J4.2 R32.1
USB2+: R40.2 U9.4(USBDP_DN2/PRT_DIS_P2)
USB2-: R39.2 U9.3(USBDM_DN2/PRT_DIS_M2)
USB2_D+: J4.7 R40.1
USB2_D-: J4.6 R39.1
USB3+: R48.2 U9.7(USBDP_DN3/PRT_DIS_P3)
USB3-: R47.2 U9.6(USBDM_DN3/PRT_DIS_M3)
USB3_D+: J7.3 R48.1
USB3_D-: J7.2 R47.1
USB4+: R50.2 U9.9(USBDP_DN4/PRT_DIS_P4)
USB4-: R49.2 U9.8(USBDM_DN4/PRT_DIS_M4)
USB4_D+: J7.7 R50.1
USB4_D-: J7.6 R49.1
USB_CN+: U14.3(D+) USB1.A6(DP1) USB1.B6(DP2)
USB_CN-: U14.4(D-) USB1.A7(DN1) USB1.B7(DN2)
USB_EMMC+: U11.9(HSD2+) U14.9(HSD2+)
USB_EMMC-: U11.8(HSD2-) U14.8(HSD2-)
USB_IN+: U9.31(USBDP_UP) U11.7(HSD1+)
USB_IN-: U9.30(USBDM_UP) U11.6(HSD1-)
USB_OCS: J4.10 R55.2 U9.13(OCS_N1) U9.17(OCS_N2) U9.19(OCS_N3) U9.21(OCS_N4)
USB_PWR: CN1.24 Q6.1(G) R2.1
USB_RESET: C17.2 R19.1 U9.26(RESET_N)
WIFI_OFF: CN1.89 J6.1
Net-(C33-2): C33.2 U13.18(LDOO)
Net-(C35-1): C35.1 U13.4(CAPM)
Net-(C35-2): C35.2 U13.2(CAPP)
Net-(C36-2): C36.2 U13.5(VNEG)
Net-(C51-2): C51.2 U9.32(XTALOUT) X3.3(OSC2)
Net-(C53-2): C53.2 U21.14(VINR)
Net-(C54-2): C54.2 U21.13(VINL)
Net-(C55-1): C55.1 U21.1(VREF)
Net-(C59-1): C59.1 R59.1 R60.2 U25.2(Inputs 1-)
Net-(C60-1): C60.1 R60.1
Net-(C62-1): C62.1 R61.1 R62.2 U25.6(Inputs 2-)
Net-(C63-1): C63.1 R62.1
Net-(C65-1): C65.1 U24.6(P1W)
Net-(C66-2): C66.2 U24.9(P0W)
Net-(C68-2): C68.2 U9.33(XTALIN/CLKIN) X3.1(OSC1)
Net-(CN2-1): CN2.1 D9.1
Net-(D8-2): D8.2(A) R35.2
Net-(D14-1): D14.1(ANODE) R57.1
Net-(D14-2): D14.2(CATHODE) Q23.3(D)
Net-(D15-1): D15.1(ANODE) R58.1
Net-(D15-2): D15.2(CATHODE) Q22.3(D)
Net-(Q6-3): Q6.3(D) Q7.1(G) R1.1
Net-(Q8-1): Q8.1(G) R10.1 U1.5(PA7)
Net-(Q16-3): Q16.3(D) Q17.1(G) R16.2
Net-(Q22-1): Q22.1(G) R70.1 U22.6(Y1#)
Net-(Q23-1): Q23.1(G) R69.1 U22.4(Y2#)
Net-(R4-2): R4.2 U5.1(TXD)
Net-(R5-2): R5.2 U5.4(RXD)
Net-(R30-1): R30.1 U9.35(RBIAS)
Net-(R37-1): R37.1 USB1.A5(CC1)
Net-(R38-2): R38.2 USB1.B5(CC2)
Net-(R42-2): R42.2 R43.2 R44.1 U17.2(IN1-)
Net-(R45-1): R45.1 R46.2 U17.6(IN2-)
Net-(R52-2): R52.2 U9.28(SUSP_IND/LOCAL_PWR/NON_REM0)
Net-(R54-2): R54.2 U1.4(PA6)
Net-(R65-2): R65.2 U26.1(VOUT) U26.4(VIN-)
Net-(R81-1): R81.1 U24.13(SDO)

Not connected (* = marked no-connect by the designer): CN1 3* 4* 5* 6* 9* 10* 11* 12* 15* 16* 17* 18* 19* 20* 28* 29* 35* 36* 41* 46* 47* 48* 58* 64* 68* 70* 72* 73* 75* 76* 88* 90* 94* 96* 97*; CN2 2* 4* 6* 9* 10* 11* 12* 15* 16* 17* 18* 21* 22* 23* 24* 27* 28* 29* 30* 33* 34* 35* 36* 39* 40* 41* 42* 43* 45* 46* 47* 48* 49* 52* 54* 57* 58* 59* 60* 63* 64* 65* 66* 69* 71* 75* 77* 81* 83* 87* 89* 93* 94* 95* 96*; FPC1 3* 7* 21* 22*; J3 3*; SW1 3*; U1 9(PC3)* 10(PD0)* 11(PD1)* 12(PD2)* 13(PD3)* 14(PD4)* 15(PD5)* 16(PD6)* 17(PD7)* 22(PF2)* 23(PF3)* 24(PF4)* 25(PF5)* 26(PF6(RESET#))*; U3 5(VREF)*; U6 3(NC)* 4(NC)* 5(NC)*; U7 1(StandBy)*; U8 3(FLG#)*; U9 12(PRTPWR1/BC_EN1)* 16(PRTPWR2/BC_EN2)* 18(PRTPWR3/BC_EN3)* 20(PRTPWR4/BC_EN4)* 22(SDA/SMBDATA/NON_REM1)*; U10 5(RI#)* 7(DSR#)* 8(DCD#)* 10(CBUS2)* 13(3V3OUT)* 17(CBUS1)* 18(CBUS0)* 19(CBUS3)*; USB1 A4(VBUS)* A8(SBU1)* A9(VBUS)* B4(VBUS)* B8(SBU2)* B9(VBUS)*; X3 2(NC)* 4(NC)*

## Notes on the sheets
sheet 1
- LEDs
- USB Power
sheet 3
- GPIO26
- GPIO16
- GPIO6
- GPIO12
- GPIO5
- GPIO7
- GPIO11
- GPIO8
- GPIO9
- GPIO24
- GPIO10
- GPIO23
- GPIO17
- GPIO4
- GPIO3
sheet 5
- DAC
sheet 10
- Input
- Input
